# EAGLE design 20230822 (EAGLE 6.6.0)

## Sheet 1 of 3
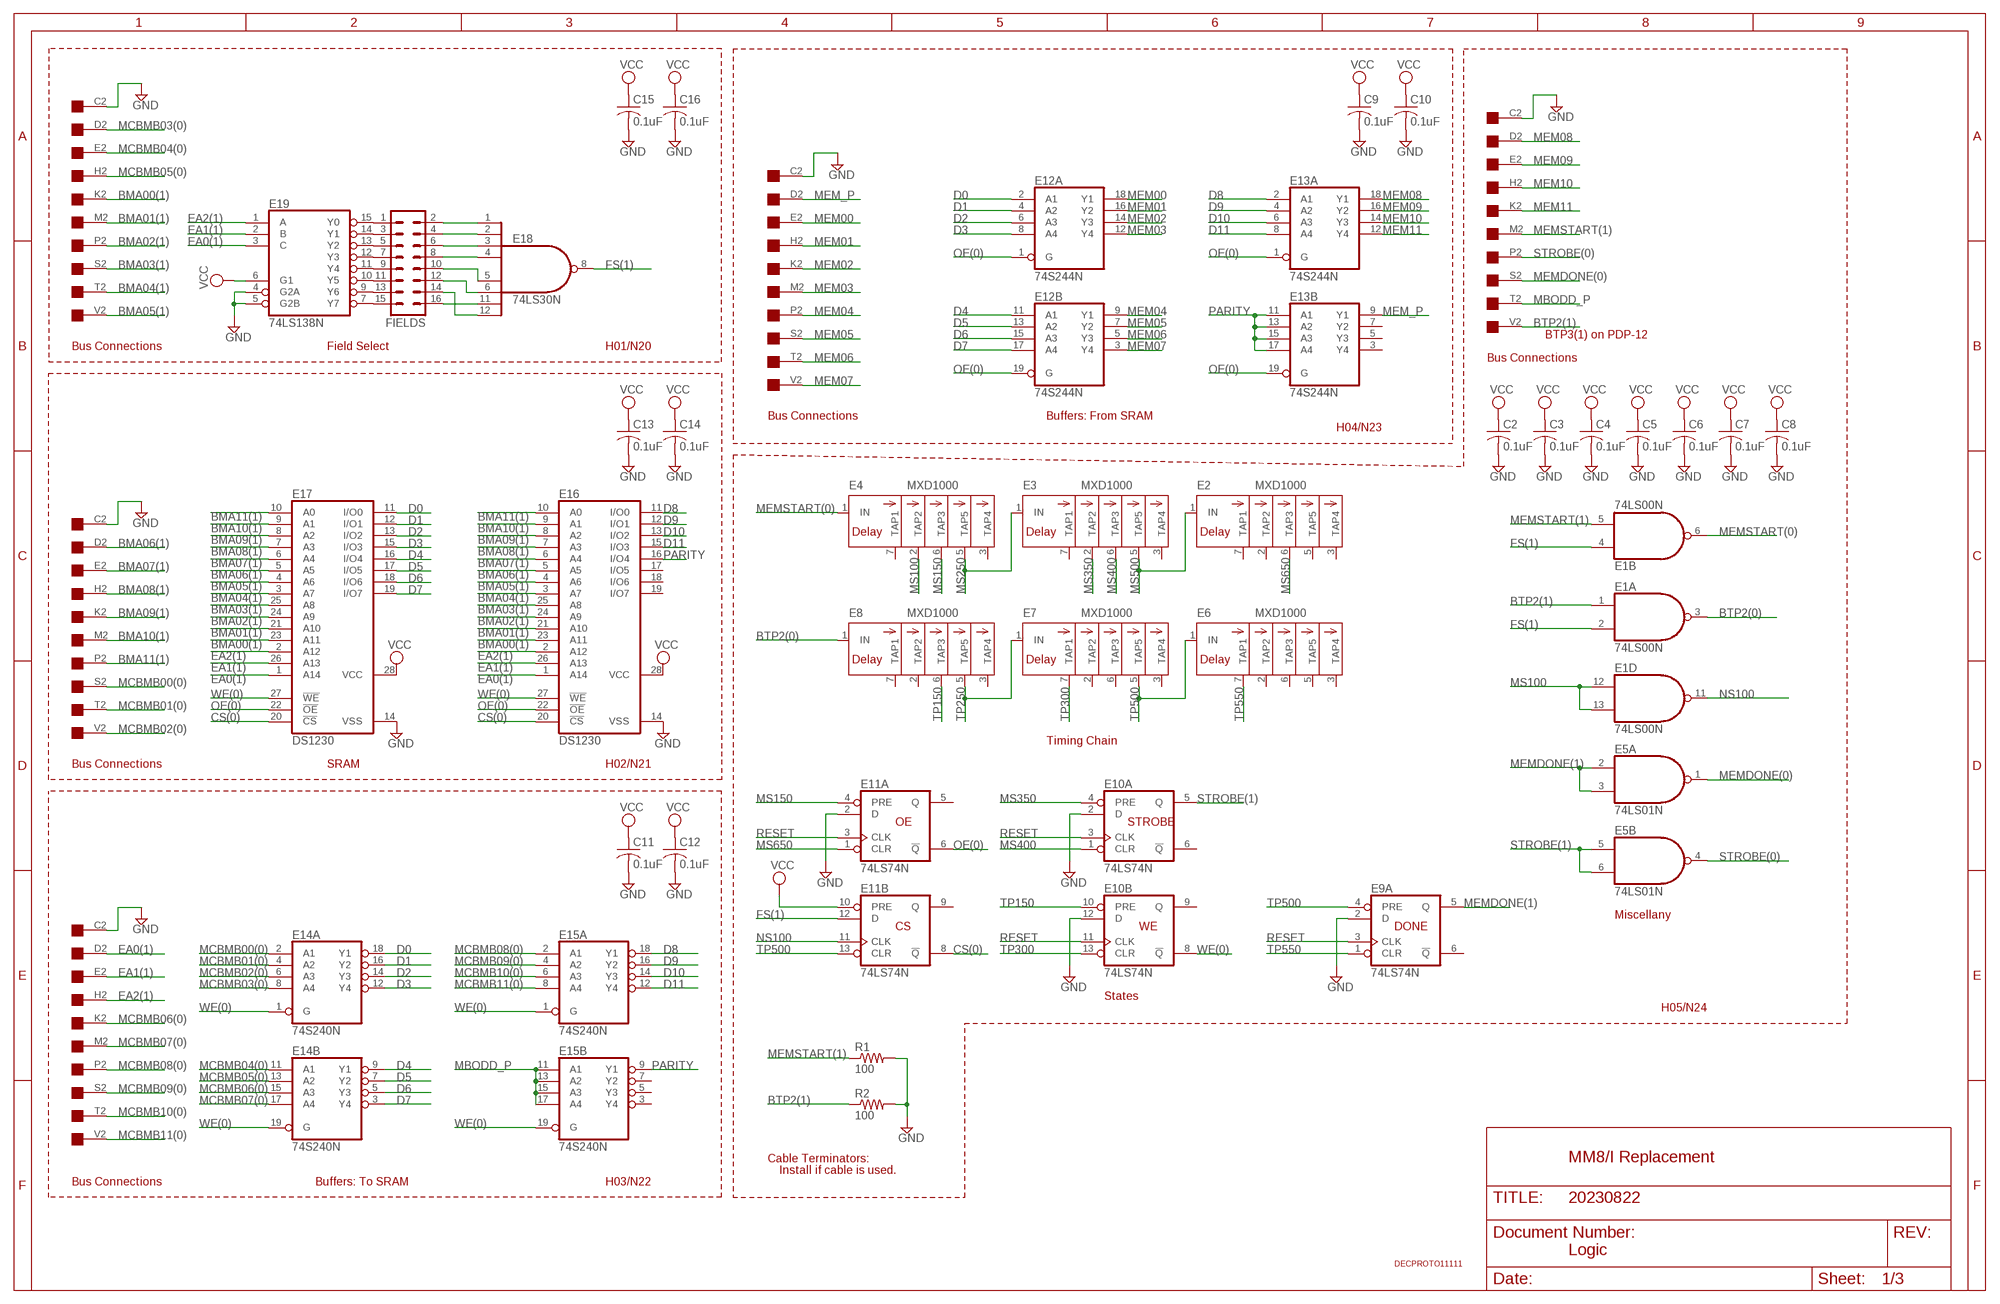
[diagram p0: schematic, sheet 1]

### Parts
C2  0.1uF  C-US050-025X075  [C050-025X075]
C3  0.1uF  C-US050-025X075  [C050-025X075]
C4  0.1uF  C-US050-025X075  [C050-025X075]
C5  0.1uF  C-US050-025X075  [C050-025X075]
C6  0.1uF  C-US050-025X075  [C050-025X075]
C7  0.1uF  C-US050-025X075  [C050-025X075]
C8  0.1uF  C-US050-025X075  [C050-025X075]
C9  0.1uF  C-US050-025X075  [C050-025X075]
C10  0.1uF  C-US050-025X075  [C050-025X075]
C11  0.1uF  C-US050-025X075  [C050-025X075]
C12  0.1uF  C-US050-025X075  [C050-025X075]
C13  0.1uF  C-US050-025X075  [C050-025X075]
C14  0.1uF  C-US050-025X075  [C050-025X075]
C15  0.1uF  C-US050-025X075  [C050-025X075]
C16  0.1uF  C-US050-025X075  [C050-025X075]
E1  74LS00N  [DIL14]
E2  MXD1000  [DIL08]
E3  MXD1000  [DIL08]
E4  MXD1000  [DIL08]
E5  74LS01N  [DIL14]
E6  MXD1000  [DIL08]
E7  MXD1000  [DIL08]
E8  MXD1000  [DIL08]
E9  74LS74N  [DIL14]
E10  74LS74N  [DIL14]
E11  74LS74N  [DIL14]
E12  74S244N  [DIL20]
E13  74S244N  [DIL20]
E14  74S240N  [DIL20]
E15  74S240N  [DIL20]
E16  DS1230  62256P  [DIL28-6]
E17  DS1230  62256P  [DIL28-6]
E18  74LS30N  [DIL14]
E19  74LS138N  [DIL16]
FIELDS  MA08-2  [MA08-2]
H01  EDGE-1  [EDGE-CON1]
H02  EDGE-1  [EDGE-CON1]
H03  EDGE-1  [EDGE-CON1]
H04  EDGE-1  [EDGE-CON1]
H05  EDGE-1  [EDGE-CON1]
R1  100  R-US_0207/10  [0207/10]
R2  100  R-US_0207/10  [0207/10]
U$6  DECPROTO11111  [DECPROTO11111]

### Nets
BMA00(1): E16.23(A11) E17.23(A11) H01.K2 ; also sheet 2
BMA01(1): E16.21(A10) E17.21(A10) H01.M2 ; also sheet 2
BMA02(1): E16.24(A9) E17.24(A9) H01.P2 ; also sheet 2
BMA03(1): E16.25(A8) E17.25(A8) H01.S2 ; also sheet 2
BMA04(1): E16.3(A7) E17.3(A7) H01.T2 ; also sheet 2
BMA05(1): E16.4(A6) E17.4(A6) H01.V2 ; also sheet 2
BMA06(1): E16.5(A5) E17.5(A5) H02.D2 ; also sheet 2
BMA07(1): E16.6(A4) E17.6(A4) H02.E2 ; also sheet 2
BMA08(1): E16.7(A3) E17.7(A3) H02.H2 ; also sheet 2
BMA09(1): E16.8(A2) E17.8(A2) H02.K2 ; also sheet 2
BMA10(1): E16.9(A1) E17.9(A1) H02.M2 ; also sheet 2
BMA11(1): E16.10(A0) E17.10(A0) H02.P2 ; also sheet 2
BTP2(0): E1.3(A:O) E8.1(IN)
BTP2(1): E1.1(A:I0) H05.V2 R2.1
CS(0): E11.8(B:!Q) E16.20(!CS) E17.20(!CS) ; also sheet 2
D0: E12.2(A:A1) E14.18(A:Y1) E17.11(I/O0) ; also sheet 2
D1: E12.4(A:A2) E14.16(A:Y2) E17.12(I/O1) ; also sheet 2
D2: E12.6(A:A3) E14.14(A:Y3) E17.13(I/O2) ; also sheet 2
D3: E12.8(A:A4) E14.12(A:Y4) E17.15(I/O3) ; also sheet 2
D4: E12.11(B:A1) E14.9(B:Y1) E17.16(I/O4) ; also sheet 2
D5: E12.13(B:A2) E14.7(B:Y2) E17.17(I/O5) ; also sheet 2
D6: E12.15(B:A3) E14.5(B:Y3) E17.18(I/O6) ; also sheet 2
D7: E12.17(B:A4) E14.3(B:Y4) E17.19(I/O7) ; also sheet 2
D8: E13.2(A:A1) E15.18(A:Y1) E16.11(I/O0) ; also sheet 2
D9: E13.4(A:A2) E15.16(A:Y2) E16.12(I/O1) ; also sheet 2
D10: E13.6(A:A3) E15.14(A:Y3) E16.13(I/O2) ; also sheet 2
D11: E13.8(A:A4) E15.12(A:Y4) E16.15(I/O3) ; also sheet 2
EA0(1): E16.1(A14) E17.1(A14) E19.3(C) H03.D2 ; also sheet 2
EA1(1): E16.26(A13) E17.26(A13) E19.2(B) H03.E2 ; also sheet 2
EA2(1): E16.2(A12) E17.2(A12) E19.1(A) H03.H2 ; also sheet 2
FS(1): E1.2(A:I1) E1.4(B:I0) E11.12(B:D) E18.8(O) ; also sheet 2
GND [supply]: C2.2 C3.2 C4.2 C5.2 C6.2 C7.2 C8.2 C9.2 C10.2 C11.2 C12.2 C13.2 C14.2 C15.2 C16.2 E9.2(A:D) E10.2(A:D) E10.12(B:D) E11.2(A:D) E16.14(VSS) E17.14(VSS) E19.4(G2A) E19.5(G2B) H01.C2 H02.C2 H03.C2 H04.C2 H05.C2 R1.2 R2.2 ; also sheet 2
MBODD_P: E15.11(B:A1) E15.13(B:A2) E15.15(B:A3) E15.17(B:A4) H05.T2 ; also sheet 2
MCBMB00(0): E14.2(A:A1) H02.S2 ; also sheet 2
MCBMB01(0): E14.4(A:A2) H02.T2 ; also sheet 2
MCBMB02(0): E14.6(A:A3) H02.V2 ; also sheet 2
MCBMB03(0): E14.8(A:A4) H01.D2 ; also sheet 2
MCBMB04(0): E14.11(B:A1) H01.E2 ; also sheet 2
MCBMB05(0): E14.13(B:A2) H01.H2 ; also sheet 2
MCBMB06(0): E14.15(B:A3) H03.K2
MCBMB07(0): E14.17(B:A4) H03.M2
MCBMB08(0): E15.2(A:A1) H03.P2
MCBMB09(0): E15.4(A:A2) H03.S2
MCBMB10(0): E15.6(A:A3) H03.T2
MCBMB11(0): E15.8(A:A4) H03.V2
MEM00: E12.18(A:Y1) H04.E2
MEM01: E12.16(A:Y2) H04.H2
MEM02: E12.14(A:Y3) H04.K2
MEM03: E12.12(A:Y4) H04.M2
MEM04: E12.9(B:Y1) H04.P2
MEM05: E12.7(B:Y2) H04.S2
MEM06: E12.5(B:Y3) H04.T2
MEM07: E12.3(B:Y4) H04.V2
MEM08: E13.18(A:Y1) H05.D2 ; also sheet 2
MEM09: E13.16(A:Y2) H05.E2 ; also sheet 2
MEM10: E13.14(A:Y3) H05.H2 ; also sheet 2
MEM11: E13.12(A:Y4) H05.K2 ; also sheet 2
MEM_P: E13.9(B:Y1) H04.D2
MEMDONE(0): E5.1(A:O) H05.S2
MEMDONE(1): E5.2(A:I0) E5.3(A:I1) E9.5(A:Q)
MEMSTART(0): E1.6(B:O) E4.1(IN) ; also sheet 2
MEMSTART(1): E1.5(B:I1) H05.M2 R1.1
MS100: E1.12(D:I0) E1.13(D:I1) E4.2(TAP2)
MS150: E4.6(TAP3) E11.4(A:PRE)
MS250: E3.1(IN) E4.5(TAP5)
MS350: E3.2(TAP2) E10.4(A:PRE)
MS400: E3.6(TAP3) E10.1(A:CLR)
MS500: E2.1(IN) E3.5(TAP5)
MS650: E2.6(TAP3) E11.1(A:CLR)
N$18: E19.15(Y0) FIELDS.1
N$19: E19.14(Y1) FIELDS.3
N$20: E19.13(Y2) FIELDS.5
N$21: E19.12(Y3) FIELDS.7
N$22: E19.11(Y4) FIELDS.9
N$23: E19.10(Y5) FIELDS.11
N$24: E19.9(Y6) FIELDS.13
N$25: E19.7(Y7) FIELDS.15
N$26: E18.4(I3) FIELDS.8
N$27: E18.3(I2) FIELDS.6
N$28: E18.2(I1) FIELDS.4
N$29: E18.1(I0) FIELDS.2
N$30: E18.5(I4) FIELDS.10
N$31: E18.6(I5) FIELDS.12
N$32: E18.12(I7) FIELDS.14
N$33: E18.11(I6) FIELDS.16
NS100: E1.11(D:O) E11.11(B:CLK)
OE(0): E11.6(A:!Q) E12.1(A:G) E12.19(B:G) E13.1(A:G) E13.19(B:G) E16.22(!OE) E17.22(!OE) ; also sheet 2
PARITY: E13.11(B:A1) E13.13(B:A2) E13.15(B:A3) E13.17(B:A4) E15.9(B:Y1) E16.16(I/O4) ; also sheet 2
RESET: E9.3(A:CLK) E10.3(A:CLK) E10.11(B:CLK) E11.3(A:CLK) ; also sheet 2
STROBE(0): E5.4(B:O) H05.P2
STROBE(1): E5.5(B:I0) E5.6(B:I1) E10.5(A:Q)
TP150: E8.6(TAP3) E10.10(B:PRE)
TP250: E7.1(IN) E8.5(TAP5)
TP300: E7.7(TAP1) E10.13(B:CLR)
TP500: E6.1(IN) E7.5(TAP5) E9.4(A:PRE) E11.13(B:CLR)
TP550: E6.7(TAP1) E9.1(A:CLR)
VCC [supply]: C2.1 C3.1 C4.1 C5.1 C6.1 C7.1 C8.1 C9.1 C10.1 C11.1 C12.1 C13.1 C14.1 C15.1 C16.1 E11.10(B:PRE) E16.28(VCC) E17.28(VCC) E19.6(G1) ; also sheet 2
WE(0): E10.8(B:!Q) E14.1(A:G) E14.19(B:G) E15.1(A:G) E15.19(B:G) E16.27(!WE) E17.27(!WE) ; also sheet 2
Unconnected: E2.2(TAP2) E2.3(TAP4) E2.5(TAP5) E2.7(TAP1) E3.3(TAP4) E3.7(TAP1) E4.3(TAP4) E4.7(TAP1) E6.2(TAP2) E6.3(TAP4) E6.5(TAP5) E6.6(TAP3) E7.2(TAP2) E7.3(TAP4) E7.6(TAP3) E8.2(TAP2) E8.3(TAP4) E8.7(TAP1) E9.6(A:!Q) E10.6(A:!Q) E10.9(B:Q) E11.5(A:Q) E11.9(B:Q) E13.3(B:Y4) E13.5(B:Y3) E13.7(B:Y2) E15.3(B:Y4) E15.5(B:Y3) E15.7(B:Y2) E16.17(I/O5) E16.18(I/O6) E16.19(I/O7) H01.A2 H01.B2 H01.F2 H01.J2 H01.L2 H01.N2 H01.R2 H01.U2 H02.A2 H02.B2 H02.F2 H02.J2 H02.L2 H02.N2 H02.R2 H02.U2 H03.A2 H03.B2 H03.F2 H03.J2 H03.L2 H03.N2 H03.R2 H03.U2 H04.A2 H04.B2 H04.F2 H04.J2 H04.L2 H04.N2 H04.R2 H04.U2 H05.A2 H05.B2 H05.F2 H05.J2 H05.L2 H05.N2 H05.R2 H05.U2

### Notes on the sheet
- BTP3(1) on PDP-12
- Bus Connections | Field Select | H01/N20
- Bus Connections
- Bus Connections | Buffers: From SRAM
- H04/N23
- Timing Chain
- Bus Connections | SRAM | H02/N21
- OE | STROBE
- Miscellany
- CS | WE | DONE
- States
- H05/N24
- Cable Terminators: | MM8/I Replacement
- Install if cable is used.
- Bus Connections | Buffers: To SRAM | H03/N22
- Logic

## Sheet 2 of 3
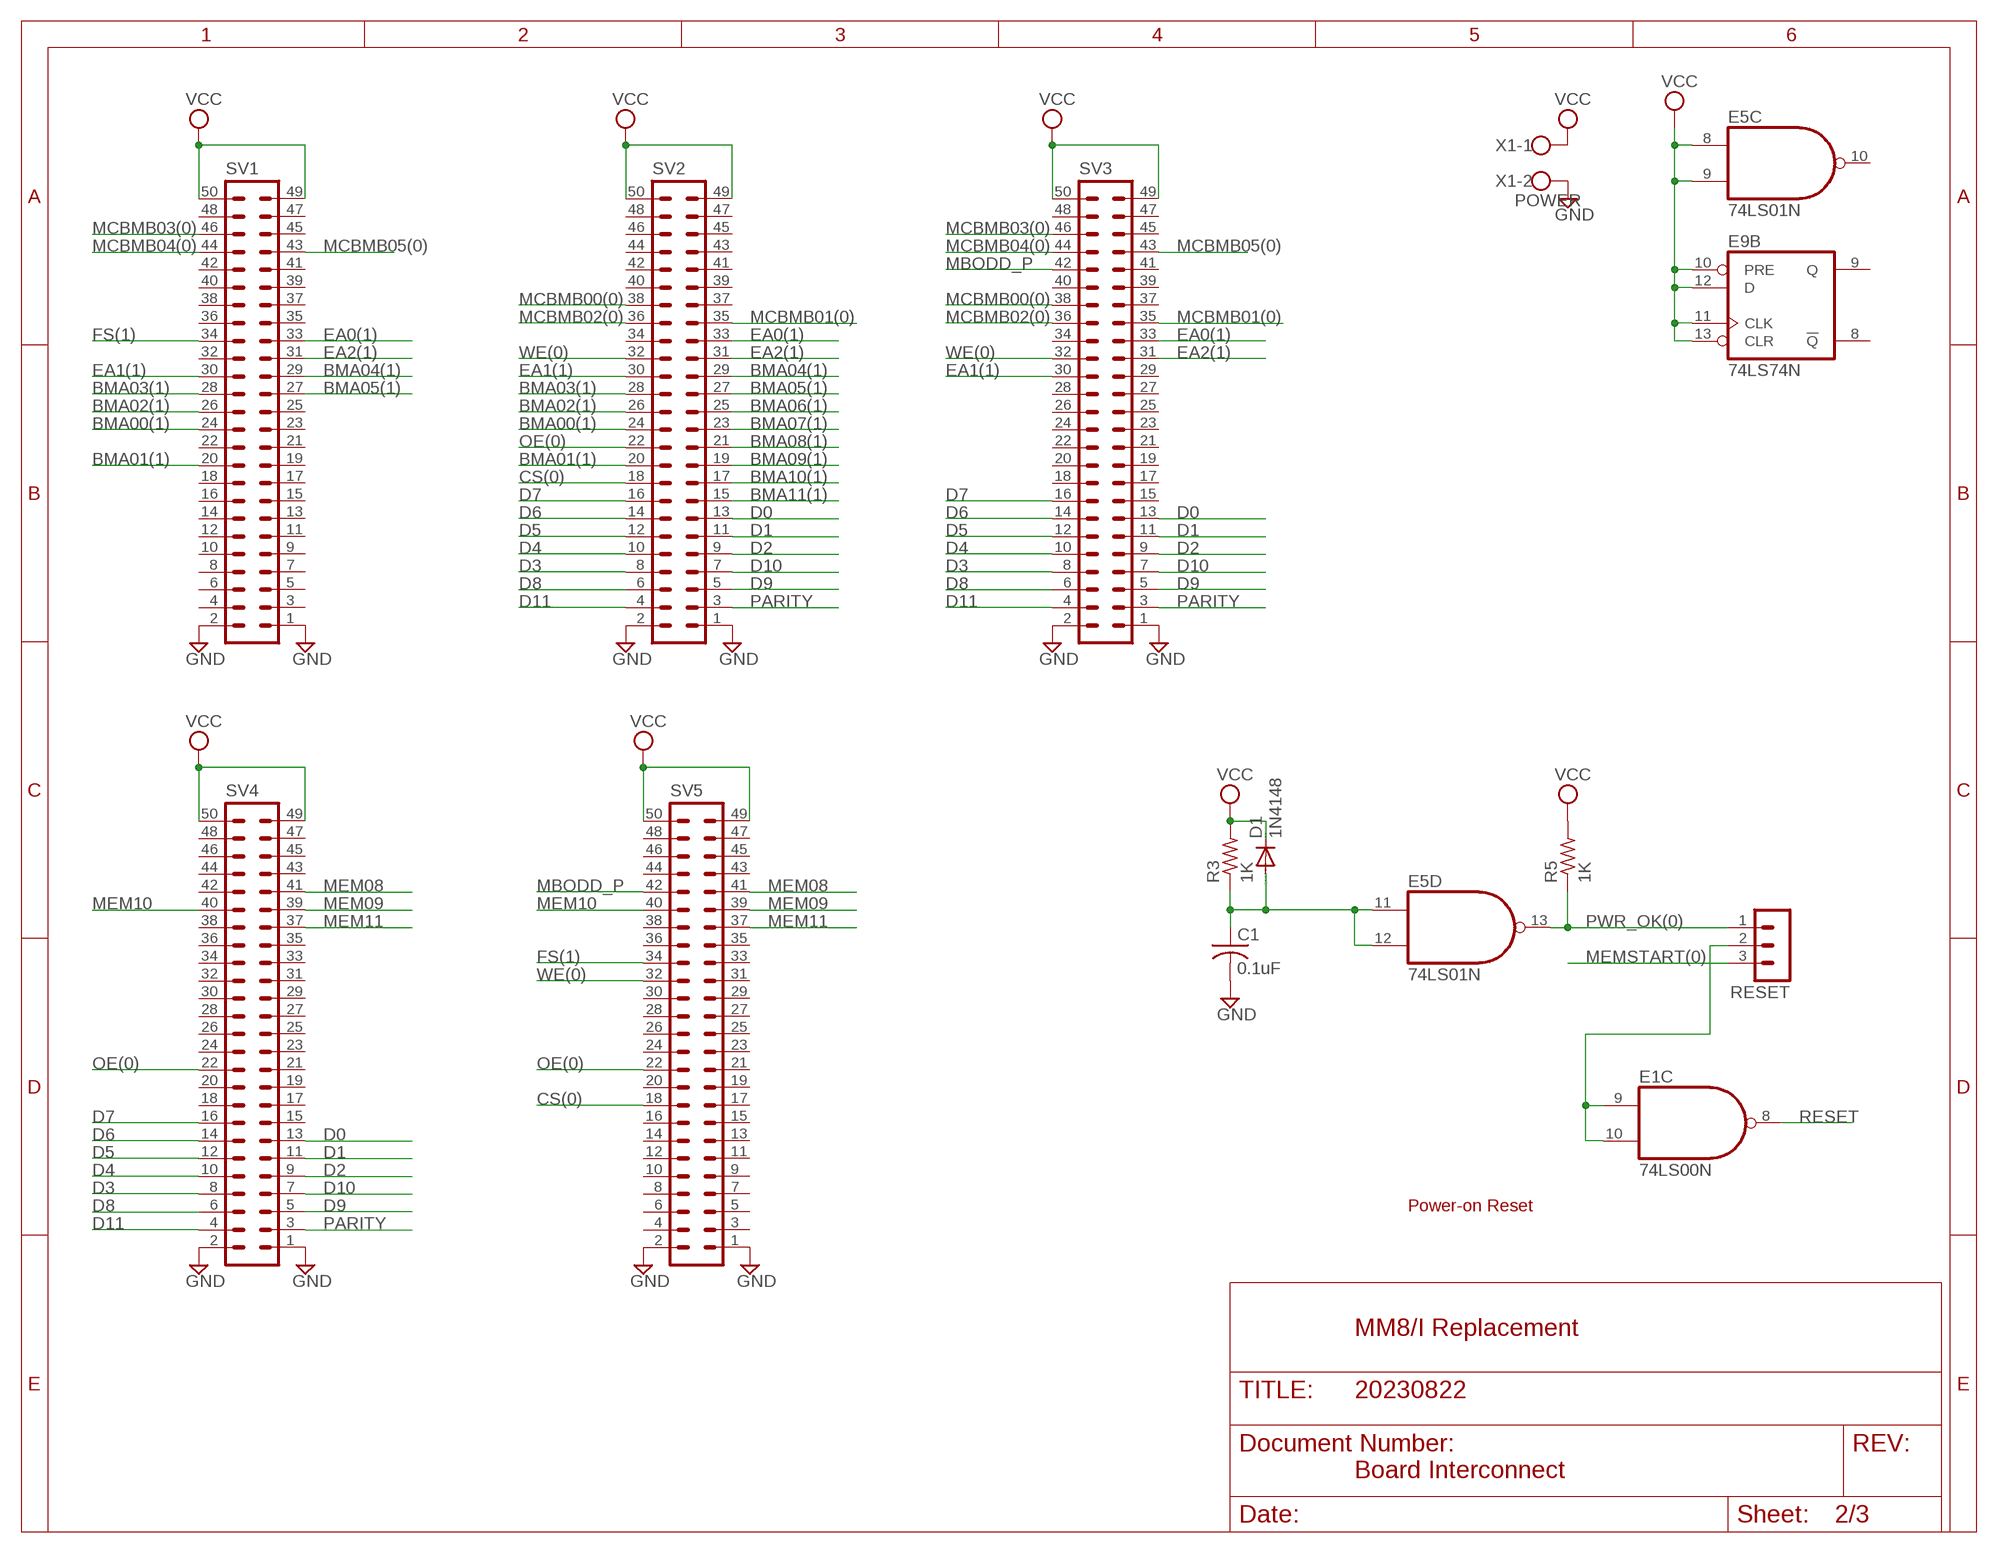
[diagram p1: schematic, sheet 2]

### Parts
C1  0.1uF  C-US050-025X075  [C050-025X075]
D1  1N4148  1N4148DO35-10  [DO35-10]
R3  1K  R-US_0207/10  [0207/10]
R5  1K  R-US_0207/10  [0207/10]
RESET  MA03-1  [MA03-1]
SV1  ML50L  [ML50L]
SV2  ML50L  [ML50L]
SV3  ML50L  [ML50L]
SV4  ML50L  [ML50L]
SV5  ML50L  [ML50L]
X1  POWER  W237-102  [W237-102]

### Nets
BMA00(1): SV1.24 SV2.24 ; also sheet 1
BMA01(1): SV1.20 SV2.20 ; also sheet 1
BMA02(1): SV1.26 SV2.26 ; also sheet 1
BMA03(1): SV1.28 SV2.28 ; also sheet 1
BMA04(1): SV1.29 SV2.29 ; also sheet 1
BMA05(1): SV1.27 SV2.27 ; also sheet 1
BMA06(1): SV2.25 ; also sheet 1
BMA07(1): SV2.23 ; also sheet 1
BMA08(1): SV2.21 ; also sheet 1
BMA09(1): SV2.19 ; also sheet 1
BMA10(1): SV2.17 ; also sheet 1
BMA11(1): SV2.15 ; also sheet 1
CS(0): SV2.18 SV5.18 ; also sheet 1
D0: SV2.13 SV3.13 SV4.13 ; also sheet 1
D1: SV2.11 SV3.11 SV4.11 ; also sheet 1
D2: SV2.9 SV3.9 SV4.9 ; also sheet 1
D3: SV2.8 SV3.8 SV4.8 ; also sheet 1
D4: SV2.10 SV3.10 SV4.10 ; also sheet 1
D5: SV2.12 SV3.12 SV4.12 ; also sheet 1
D6: SV2.14 SV3.14 SV4.14 ; also sheet 1
D7: SV2.16 SV3.16 SV4.16 ; also sheet 1
D8: SV2.6 SV3.6 SV4.6 ; also sheet 1
D9: SV2.5 SV3.5 SV4.5 ; also sheet 1
D10: SV2.7 SV3.7 SV4.7 ; also sheet 1
D11: SV2.4 SV3.4 SV4.4 ; also sheet 1
EA0(1): SV1.33 SV2.33 SV3.33 ; also sheet 1
EA1(1): SV1.30 SV2.30 SV3.30 ; also sheet 1
EA2(1): SV1.31 SV2.31 SV3.31 ; also sheet 1
FS(1): SV1.34 SV5.34 ; also sheet 1
GND [supply]: C1.2 SV1.1 SV1.2 SV2.1 SV2.2 SV3.1 SV3.2 SV4.1 SV4.2 SV5.1 SV5.2 X1.2 ; also sheet 1
MBODD_P: SV3.42 SV5.42 ; also sheet 1
MCBMB00(0): SV2.38 SV3.38 ; also sheet 1
MCBMB01(0): SV2.35 SV3.35 ; also sheet 1
MCBMB02(0): SV2.36 SV3.36 ; also sheet 1
MCBMB03(0): SV1.46 SV3.46 ; also sheet 1
MCBMB04(0): SV1.44 SV3.44 ; also sheet 1
MCBMB05(0): SV1.43 SV3.43 ; also sheet 1
MEM08: SV4.41 SV5.41 ; also sheet 1
MEM09: SV4.39 SV5.39 ; also sheet 1
MEM10: SV4.40 SV5.40 ; also sheet 1
MEM11: SV4.37 SV5.37 ; also sheet 1
MEMSTART(0): RESET.3 ; also sheet 1
N$1: E1.9(C:I0) E1.10(C:I1) RESET.2
OE(0): SV2.22 SV4.22 SV5.22 ; also sheet 1
PARITY: SV2.3 SV3.3 SV4.3 ; also sheet 1
PWR_OK: C1.1 D1.A E5.11(D:I0) E5.12(D:I1) R3.1
PWR_OK(0): E5.13(D:O) R5.1 RESET.1
RESET: E1.8(C:O) ; also sheet 1
VCC [supply]: D1.C E5.8(C:I0) E5.9(C:I1) E9.10(B:PRE) E9.11(B:CLK) E9.12(B:D) E9.13(B:CLR) R3.2 R5.2 SV1.49 SV1.50 SV2.49 SV2.50 SV3.49 SV3.50 SV4.49 SV4.50 SV5.49 SV5.50 X1.1 ; also sheet 1
WE(0): SV2.32 SV3.32 SV5.32 ; also sheet 1
Unconnected: E5.10(C:O) E9.8(B:!Q) E9.9(B:Q) SV1.3 SV1.4 SV1.5 SV1.6 SV1.7 SV1.8 SV1.9 SV1.10 SV1.11 SV1.12 SV1.13 SV1.14 SV1.15 SV1.16 SV1.17 SV1.18 SV1.19 SV1.21 SV1.22 SV1.23 SV1.25 SV1.32 SV1.35 SV1.36 SV1.37 SV1.38 SV1.39 SV1.40 SV1.41 SV1.42 SV1.45 SV1.47 SV1.48 SV2.34 SV2.37 SV2.39 SV2.40 SV2.41 SV2.42 SV2.43 SV2.44 SV2.45 SV2.46 SV2.47 SV2.48 SV3.15 SV3.17 SV3.18 SV3.19 SV3.20 SV3.21 SV3.22 SV3.23 SV3.24 SV3.25 SV3.26 SV3.27 SV3.28 SV3.29 SV3.34 SV3.37 SV3.39 SV3.40 SV3.41 SV3.45 SV3.47 SV3.48 SV4.15 SV4.17 SV4.18 SV4.19 SV4.20 SV4.21 SV4.23 SV4.24 SV4.25 SV4.26 SV4.27 SV4.28 SV4.29 SV4.30 SV4.31 SV4.32 SV4.33 SV4.34 SV4.35 SV4.36 SV4.38 SV4.42 SV4.43 SV4.44 SV4.45 SV4.46 SV4.47 SV4.48 SV5.3 SV5.4 SV5.5 SV5.6 SV5.7 SV5.8 SV5.9 SV5.10 SV5.11 SV5.12 SV5.13 SV5.14 SV5.15 SV5.16 SV5.17 SV5.19 SV5.20 SV5.21 SV5.23 SV5.24 SV5.25 SV5.26 SV5.27 SV5.28 SV5.29 SV5.30 SV5.31 SV5.33 SV5.35 SV5.36 SV5.38 SV5.43 SV5.44 SV5.45 SV5.46 SV5.47 SV5.48

### Notes on the sheet
- Power-on Reset
- MM8/I Replacement
- Board Interconnect

## Sheet 3 of 3
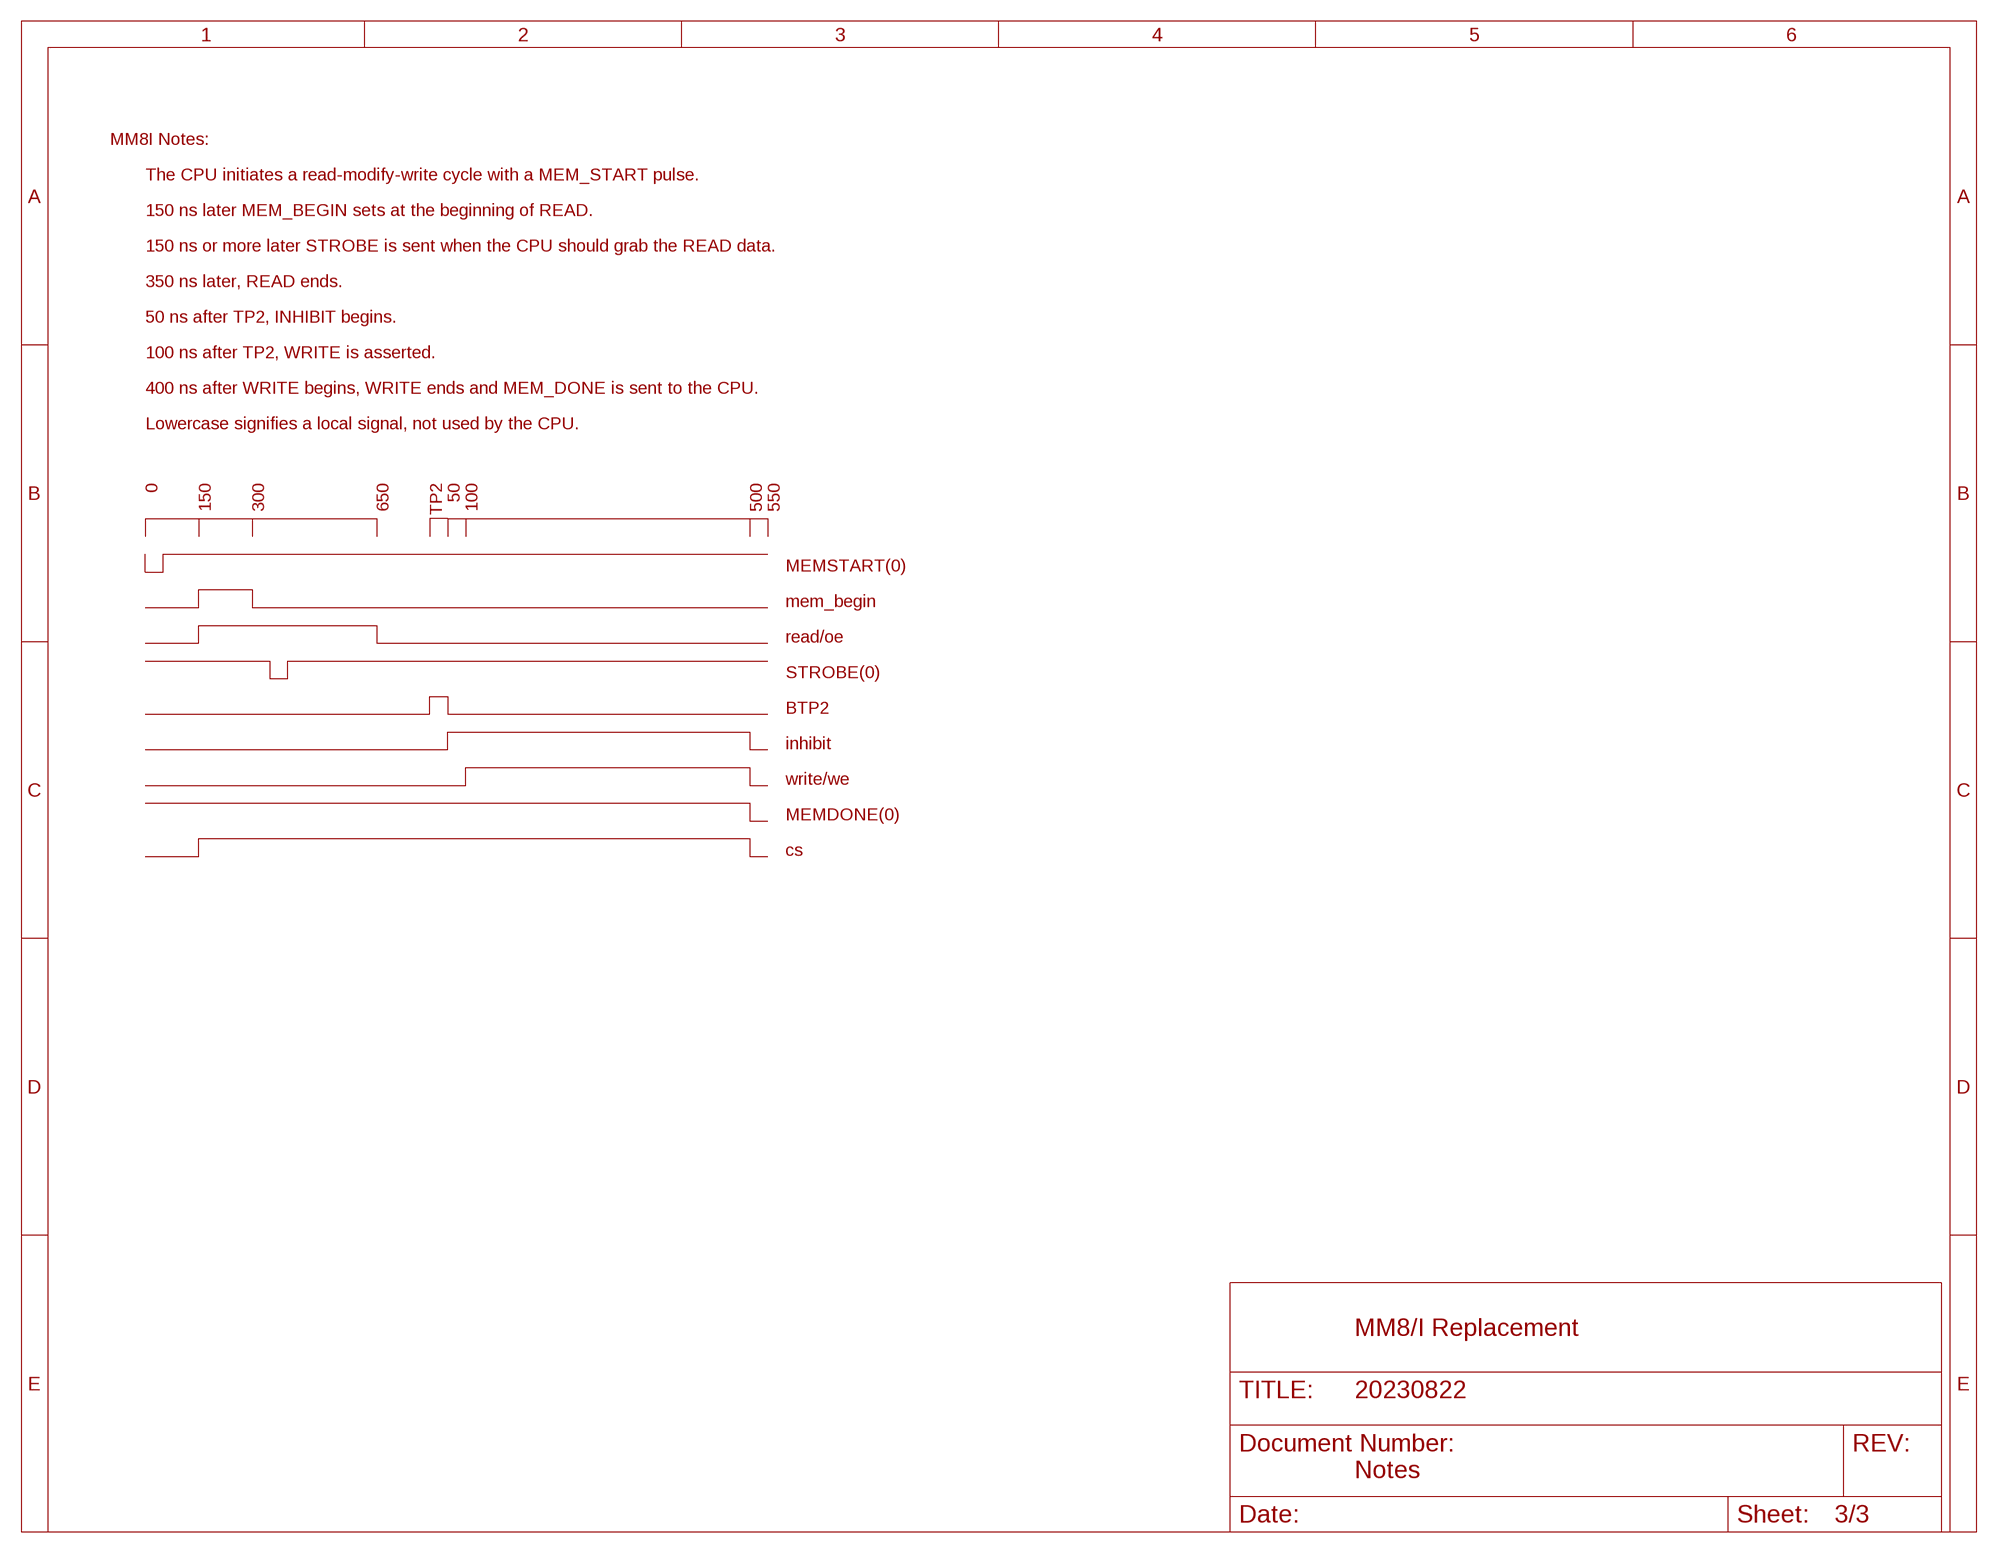
[diagram p2: schematic, sheet 3]

### Notes on the sheet
- MM8I Notes:
- The CPU initiates a read-modify-write cycle with a MEM_START pulse.
- 150 ns later MEM_BEGIN sets at the beginning of READ.
- 150 ns or more later STROBE is sent when the CPU should grab the READ data.
- 350 ns later, READ ends.
- 50 ns after TP2, INHIBIT begins.
- 100 ns after TP2, WRITE is asserted.
- 400 ns after WRITE begins, WRITE ends and MEM_DONE is sent to the CPU.
- Lowercase signifies a local signal, not used by the CPU.
- 0 | 150 | 300 | 650 | TP2 | 50 | 100 | 500 | 550
- MEMSTART(0)
- mem_begin
- read/oe
- STROBE(0)
- BTP2
- inhibit
- write/we
- MEMDONE(0)
- cs
- MM8/I Replacement
- Notes

## Power pins joined to a net without a drawn wire
GND: E1.7(P:GND) E2.4(GND) E3.4(GND) E4.4(GND) E5.7(P:GND) E6.4(GND) E7.4(GND) E8.4(GND) E9.7(P:GND) E10.7(P:GND) E11.7(P:GND) E12.10(P:GND) E13.10(P:GND) E14.10(P:GND) E15.10(P:GND) E18.7(GND) E19.8(GND)
VCC: E1.14(P:VCC) E2.8(VCC) E3.8(VCC) E4.8(VCC) E5.14(P:VCC) E6.8(VCC) E7.8(VCC) E8.8(VCC) E9.14(P:VCC) E10.14(P:VCC) E11.14(P:VCC) E12.20(P:VCC) E13.20(P:VCC) E14.20(P:VCC) E15.20(P:VCC) E18.14(VCC) E19.16(VCC)

## Library data of the parts
C1-C16 = rcl:C-US: CAPACITOR, American symbol
D1 = diode:1N4148: DIODE high speed (Philips)
E1 = 74xx-us:74*00: Quad 2-input NAND gate
E2-E4 E6-E8 = maxim:MXD1000: DELAY LINE; OC_FARNELL: unknown; OC_NEWARK: unknown
E5 = 74xx-us:74*01: Quad 2-input NAND gate, open collector
E9-E11 = 74xx-us:74*74: Dual D type positive edge triggered FLIP FLOP, preset and clear
E12 E13 = 74xx-us:74*244: Octal BUFFER and LINE DRIVER, 3-state
E14 E15 = 74xx-us:74*240: Octal BUFFER and LINE DRIVER, 3-state
E16 E17 = memory-hitachi:62256P: MEMORY; OC_FARNELL: unknown; OC_NEWARK: unknown
E18 = 74xx-us:74*30: 8-input NAND gate
E19 = 74xx-us:74*138: 3-line to 8-line DECODER/DEMULTIPLEXER
FIELDS = con-lstb:MA08-2: PIN HEADER; OC_FARNELL: unknown; OC_NEWARK: unknown
H01-H05 = dec-con:EDGE-1: Single-Sided DEC Edge Connector -- (side 2)
R1-R3 R5 = rcl:R-US_: RESISTOR, American symbol
RESET = con-lstb:MA03-1: PIN HEADER; OC_FARNELL: unknown; OC_NEWARK: unknown
SV1-SV5 = con-ml:ML50L: HARTING; OC_FARNELL: unknown; OC_NEWARK: unknown
U$6 = dec-con:DECPROTO: Various small DEC boards stuck together with break-away tab routing.
X1 = con-wago-500:W237-102: WAGO SCREW CLAMP; MPN: 237-102; OC_FARNELL: unknown; OC_NEWARK: 70K9898

## Net classes
1 supply: width 0.711 mm

## Board
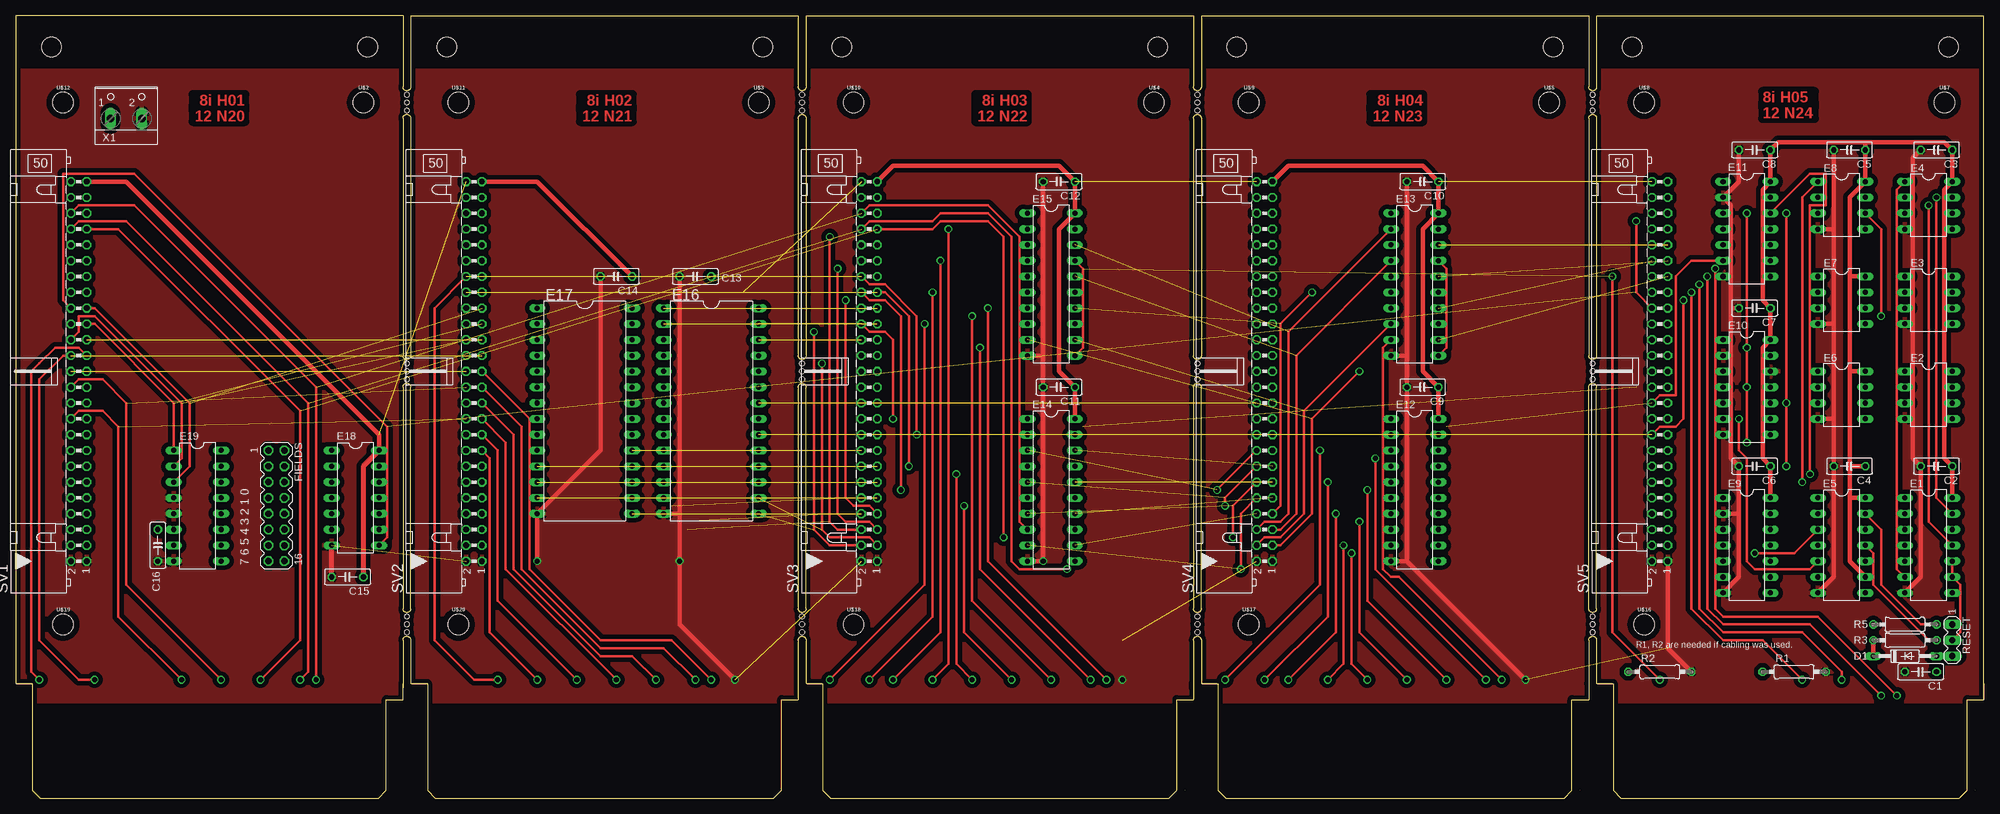
[diagram p3: board, top side]
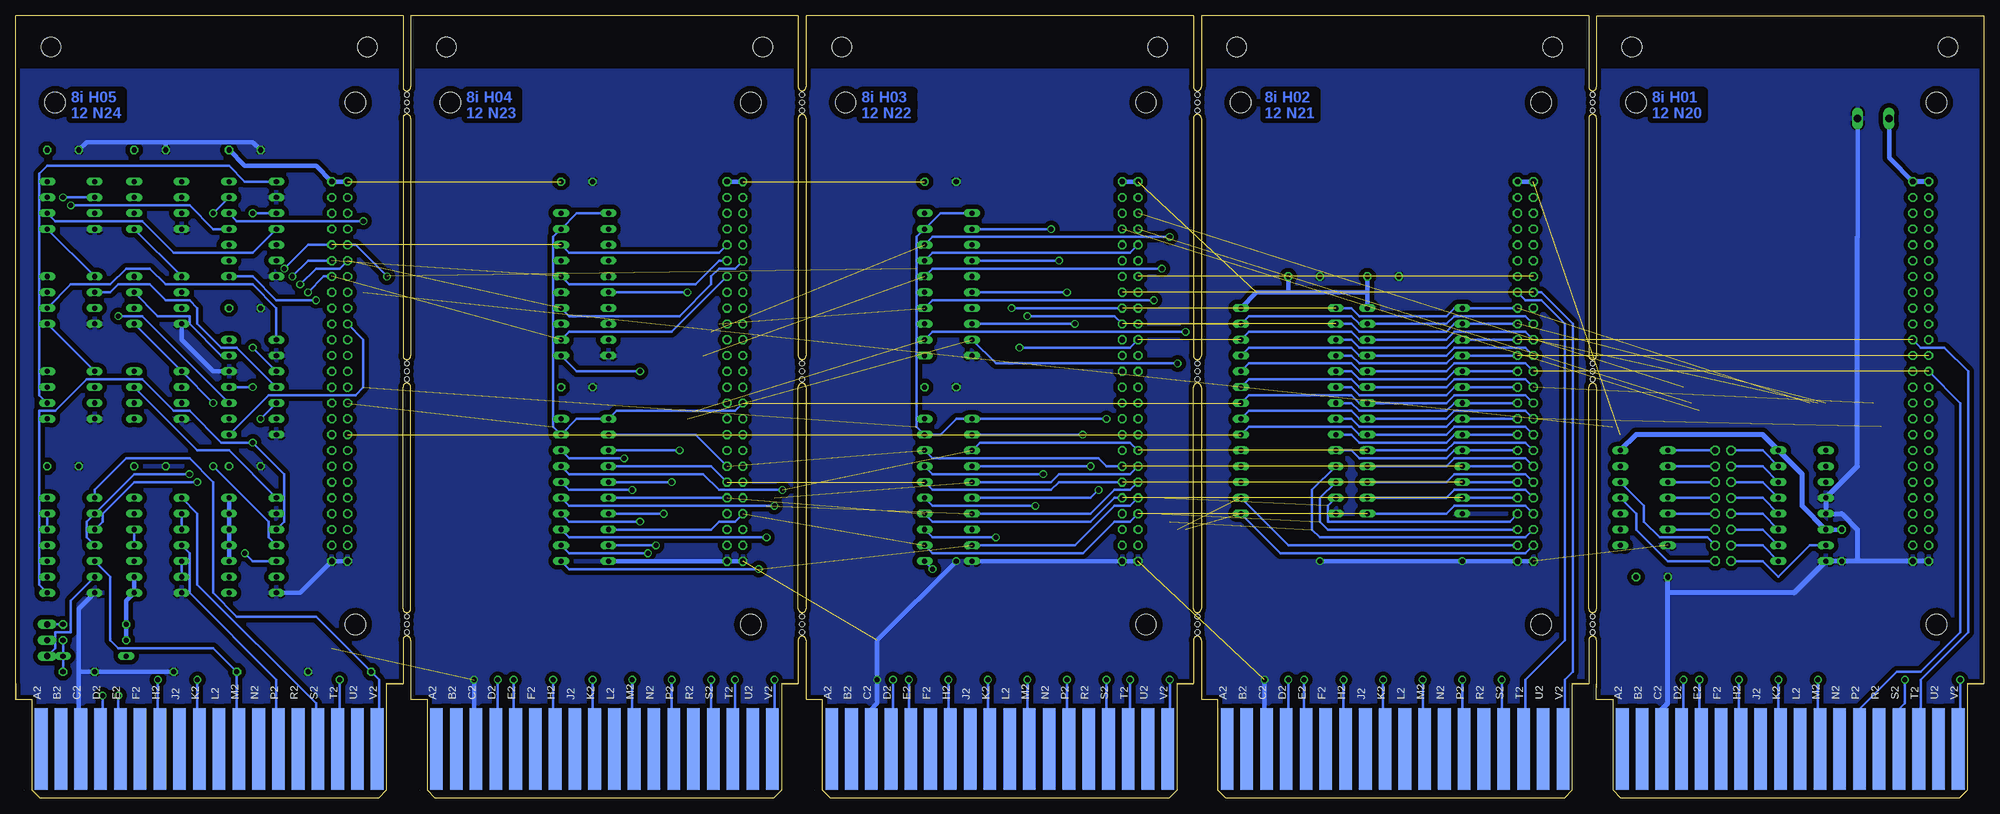
[diagram p4: board, bottom side, seen from below]

Size 316.23 x 125.73 mm. Coordinates in mm from the lower left corner, seen from the top.
Copper layers (1+16): Top 0.035mm / dielectric 1.5mm / Bottom 0.035mm
Design rules "16mils": minimum track width 16mil, minimum drill 32mil, track to track 15mil, track to pad 10mil, pad to pad 10mil, via to via 10mil, smd to smd 10mil, copper to edge 13mil, drill to drill 10mil, minimum pad ring 10mil, minimum via ring 8mil, stop-mask expansion 0mil, vias tented up to drill 0mil, thermal gap 10mil

### Footprints (pad centres in the part's own frame; a part is rotated, then mirrored left to right if it is on the bottom)
C050-025X075 = drill 0.813 octagon: 1 -2.54,0; 2 2.54,0
DO35-10 = drill 0.813 long: A 5.08,0; C -5.08,0
DIL14 = drill 0.813 long: 1 -7.62,-3.81; 2 -5.08,-3.81; 3 -2.54,-3.81; 4 0,-3.81; 5 2.54,-3.81; 6 5.08,-3.81; 7 7.62,-3.81; 8 7.62,3.81; 9 5.08,3.81; 10 2.54,3.81; 11 0,3.81; 12 -2.54,3.81; 13 -5.08,3.81; 14 -7.62,3.81
DIL08 = drill 0.813 long: 1 -3.81,-3.81; 2 -1.27,-3.81; 3 1.27,-3.81; 4 3.81,-3.81; 5 3.81,3.81; 6 1.27,3.81; 7 -1.27,3.81; 8 -3.81,3.81
DIL20 = drill 0.813 long: 1 -11.43,-3.81; 2 -8.89,-3.81; 3 -6.35,-3.81; 4 -3.81,-3.81; 5 -1.27,-3.81; 6 1.27,-3.81; 7 3.81,-3.81; 8 6.35,-3.81; 9 8.89,-3.81; 10 11.43,-3.81; 11 11.43,3.81; 12 8.89,3.81; 13 6.35,3.81; 14 3.81,3.81; 15 1.27,3.81; 16 -1.27,3.81; 17 -3.81,3.81; 18 -6.35,3.81; 19 -8.89,3.81; 20 -11.43,3.81
DIL28-6 = drill 0.813 long: 1 -16.51,-7.62; 2 -13.97,-7.62; 3 -11.43,-7.62; 4 -8.89,-7.62; 5 -6.35,-7.62; 6 -3.81,-7.62; 7 -1.27,-7.62; 8 1.27,-7.62; 9 3.81,-7.62; 10 6.35,-7.62; 11 8.89,-7.62; 12 11.43,-7.62; 13 13.97,-7.62; 14 16.51,-7.62; 15 16.51,7.62; 16 13.97,7.62; 17 11.43,7.62; 18 8.89,7.62; 19 6.35,7.62; 20 3.81,7.62; 21 1.27,7.62; 22 -1.27,7.62; 23 -3.81,7.62; 24 -6.35,7.62; 25 -8.89,7.62; 26 -11.43,7.62; 27 -13.97,7.62; 28 -16.51,7.62
DIL16 = drill 0.813 long: 1 -8.89,-3.81; 2 -6.35,-3.81; 3 -3.81,-3.81; 4 -1.27,-3.81; 5 1.27,-3.81; 6 3.81,-3.81; 7 6.35,-3.81; 8 8.89,-3.81; 9 8.89,3.81; 10 6.35,3.81; 11 3.81,3.81; 12 1.27,3.81; 13 -1.27,3.81; 14 -3.81,3.81; 15 -6.35,3.81; 16 -8.89,3.81
MA08-2 = drill 1.016 octagon: 1 -8.89,-1.27; 2 -8.89,1.27; 3 -6.35,-1.27; 4 -6.35,1.27; 5 -3.81,-1.27; 6 -3.81,1.27; 7 -1.27,-1.27; 8 -1.27,1.27; 9 1.27,-1.27; 10 1.27,1.27; 11 3.81,-1.27; 12 3.81,1.27; 13 6.35,-1.27; 14 6.35,1.27; 15 8.89,-1.27; 16 8.89,1.27
EDGE-CON1 = smd 13.106 x 2.032 bottom: A2 7.938,4.128; B2 7.938,7.303; C2 7.938,10.477; D2 7.938,13.652; E2 7.938,16.828; F2 7.938,20.003; H2 7.938,23.177; J2 7.938,26.352; K2 7.938,29.527; L2 7.938,32.703; M2 7.938,35.877; N2 7.938,39.053; P2 7.938,42.227; R2 7.938,45.403; S2 7.938,48.578; T2 7.938,51.752; U2 7.938,54.928; V2 7.938,58.102
0207/10 = drill 0.813 octagon: 1 -5.08,0; 2 5.08,0
MA03-1 = drill 1.016 long: 1 -2.54,0; 2 0,0; 3 2.54,0
ML50L = drill 0.914 octagon: 1 -30.48,-1.27; 2 -30.48,1.27; 3 -27.94,-1.27; 4 -27.94,1.27; 5 -25.4,-1.27; 6 -25.4,1.27; 7 -22.86,-1.27; 8 -22.86,1.27; 9 -20.32,-1.27; 10 -20.32,1.27; 11 -17.78,-1.27; 12 -17.78,1.27; 13 -15.24,-1.27; 14 -15.24,1.27; 15 -12.7,-1.27; 16 -12.7,1.27; 17 -10.16,-1.27; 18 -10.16,1.27; 19 -7.62,-1.27; 20 -7.62,1.27; 21 -5.08,-1.27; 22 -5.08,1.27; 23 -2.54,-1.27; 24 -2.54,1.27; 25 0,-1.27; 26 0,1.27; 27 2.54,-1.27; 28 2.54,1.27; 29 5.08,-1.27; 30 5.08,1.27; 31 7.62,-1.27; 32 7.62,1.27; 33 10.16,-1.27; 34 10.16,1.27; 35 12.7,-1.27; 36 12.7,1.27; 37 15.24,-1.27; 38 15.24,1.27; 39 17.78,-1.27; 40 17.78,1.27; 41 20.32,-1.27; 42 20.32,1.27; 43 22.86,-1.27; 44 22.86,1.27; 45 25.4,-1.27; 46 25.4,1.27; 47 27.94,-1.27; 48 27.94,1.27; 49 30.48,-1.27; 50 30.48,1.27
STAND-OFF = hole 3.302: 0,0
DECPROTO11111 = hole 3.175: 183.515,120.65; 132.715,120.65; 69.266,120.65; 120.066,120.65; 56.566,120.65; 5.766,120.65; 247.015,120.65; 196.215,120.65; 310.515,120.65; 259.715,120.65 | hole 0.813: 62.865,69.85; 62.865,68.58; 62.865,67.31; 62.865,26.67; 62.865,27.94; 62.865,29.21; 62.865,113.03; 62.865,110.49; 62.865,111.76; 126.365,69.85; 126.365,68.58; 126.365,67.31; 126.365,26.67; 126.365,27.94; 126.365,29.21; 126.365,113.03; 126.365,110.49; 126.365,111.76; 189.865,26.67; 189.865,27.94; 189.865,29.21; 189.865,67.31; 189.865,68.58; 189.865,69.85; 189.865,110.49; 189.865,111.76; 189.865,113.03; 253.365,26.67; 253.365,27.94; 253.365,29.21; 253.365,67.31; 253.365,68.58; 253.365,69.85; 253.365,110.49; 253.365,111.76; 253.365,113.03
W237-102 = drill 1.194 long: 1 -2.5,-1.27; 2 2.5,-1.27

### Placement (x,y rotation side)
C1  306.07,20.32 180 top
C2  308.61,53.34 180 top
C3  308.61,104.14 180 top
C4  294.64,53.34 180 top
C5  294.64,104.14 180 top
C6  279.4,53.34 180 top
C7  279.4,78.74 180 top
C8  279.4,104.14 180 top
C9  226.06,66.04 180 top
C10  226.06,99.06 180 top
C11  167.64,66.04 180 top
C12  167.64,99.06 180 top
C13  109.22,83.82 180 top
C14  96.52,83.82 180 top
C15  53.34,35.56 180 top
C16  22.86,40.64 270 top
D1  303.53,22.86 0 top
E1  307.34,40.64 270 top
E2  307.34,64.77 270 top
E3  307.34,80.01 270 top
E4  307.34,95.25 270 top
E5  293.37,40.64 270 top
E6  293.37,64.77 270 top
E7  293.37,80.01 270 top
E8  293.37,95.25 270 top
E9  278.13,40.64 270 top
E10  278.13,66.04 270 top
E11  278.13,91.44 270 top
E12  224.79,49.53 270 top
E13  224.79,82.55 270 top
E14  166.37,49.53 270 top
E15  166.37,82.55 270 top
E16  111.76,62.23 270 top
E17  91.44,62.23 270 top
E18  54.61,48.26 270 top
E19  29.21,46.99 270 top
FIELDS  41.91,46.99 270 top
H01  62.23,0 90 top
H02  125.73,0 90 top
H03  189.23,0 90 top
H04  252.73,0 90 top
H05  316.23,0 90 top
R1  285.75,20.32 0 top
R2  264.16,20.32 0 top
R3  303.53,25.4 180 top
R5  303.53,27.94 180 top
RESET  311.15,25.4 270 top
SV1  10.16,68.58 90 top
SV2  73.66,68.58 90 top
SV3  137.16,68.58 90 top
SV4  200.66,68.58 90 top
SV5  264.16,68.58 90 top
U$2  [STAND-OFF]  55.88,111.76 0 top
U$3  [STAND-OFF]  119.38,111.76 0 top
U$4  [STAND-OFF]  182.88,111.76 0 top
U$5  [STAND-OFF]  246.38,111.76 0 top
U$6  0,0 0 top
U$7  [STAND-OFF]  309.88,111.76 0 top
U$8  [STAND-OFF]  261.62,111.76 0 top
U$9  [STAND-OFF]  198.12,111.76 0 top
U$10  [STAND-OFF]  134.62,111.76 0 top
U$11  [STAND-OFF]  71.12,111.76 0 top
U$12  [STAND-OFF]  7.62,111.76 0 top
U$16  [STAND-OFF]  261.62,27.94 0 top
U$17  [STAND-OFF]  198.12,27.94 0 top
U$18  [STAND-OFF]  134.62,27.94 0 top
U$19  [STAND-OFF]  7.62,27.94 0 top
U$20  [STAND-OFF]  71.12,27.94 0 top
X1  17.78,110.49 0 top

### Tracks (layer width: path | path; a pad name or v marks a point on that pad's centre or on a via)
BMA00(1)  (via drill 0.81)  (1 unrouted)
  Top 0.406: SV1.24 10.16,67.31 13.97,67.31 17.78,63.5 17.78,34.29 v33.02,19.05
  Bottom 0.406: H01.K2 32.7,8.57 33.02,8.89 v33.02,19.05 | E16.23 118.11,67.31 101.6,67.31 100.33,66.04 E17.23 86.36,66.04 85.09,67.31 73.66,67.31 SV2.24
BMA01(1)  (via drill 0.81)  (1 unrouted)
  Top 0.406: SV1.20 10.16,62.23 13.97,62.23 16.51,59.69 16.51,29.21 v26.67,19.05
  Bottom 0.406: H01.M2 26.35,8.57 26.67,8.89 v26.67,19.05 | E16.21 118.11,62.23 101.6,62.23 100.33,60.96 E17.21 86.36,60.96 85.09,62.23 73.66,62.23 SV2.20
BMA02(1)  (1 unrouted)
  Bottom 0.406: H01.P2 20,8.57 20.32,8.89 20.32,13.97 13.97,20.32 10.16,20.32 3.81,26.67 3.81,63.5 SV1.26 | E16.24 118.11,69.85 101.6,69.85 100.33,68.58 E17.24 86.36,68.58 85.09,69.85 73.66,69.85 SV2.26
BMA03(1)  (via drill 0.81)  (1 unrouted)
  Top 0.406: SV1.28 7.62,71.12 3.81,67.31 3.81,25.4 10.16,19.05 v12.7,19.05
  Bottom 0.406: H01.S2 13.65,8.57 13.97,8.89 13.97,13.97 12.7,15.24 v12.7,19.05 | E16.25 118.11,72.39 101.6,72.39 100.33,71.12 E17.25 86.36,71.12 85.09,72.39 73.66,72.39 SV2.28
BMA04(1)  (1 unrouted)
  Bottom 0.406: H01.T2 10.48,8.57 10.16,8.89 10.16,19.05 2.54,26.67 2.54,68.58 6.35,72.39 10.16,72.39 SV1.29 | E16.3 101.6,73.66 100.33,72.39 86.36,72.39 85.09,73.66 E17.3 SV2.29
BMA05(1)  (via drill 0.81)  (1 unrouted)
  Top 0.406: SV1.27 10.16,72.39 6.35,72.39 3.81,69.85 2.54,68.58 2.54,20.32 v3.81,19.05
  Bottom 0.406: H01.V2 4.13,8.57 3.81,8.89 v3.81,19.05 | E16.4 101.6,71.12 100.33,69.85 86.36,69.85 85.09,71.12 E17.4 SV2.27
BMA06(1)  (via drill 0.81)
  Top 0.406: SV2.25 82.55,60.96 82.55,36.83 93.98,25.4 105.41,25.4 v111.76,19.05
  Bottom 0.406: H02.D2 112.08,8.57 111.76,8.89 v111.76,19.05 | E16.5 101.6,68.58 100.33,67.31 86.36,67.31 85.09,68.58 E17.5 SV2.25
BMA07(1)  (via drill 0.81)
  Top 0.406: SV2.23 81.28,59.69 81.28,36.83 93.98,24.13 104.14,24.13 v109.22,19.05
  Bottom 0.406: H02.E2 108.9,8.57 109.22,8.89 v109.22,19.05 | E16.6 101.6,66.04 100.33,64.77 86.36,64.77 85.09,66.04 E17.6 SV2.23
BMA08(1)  (via drill 0.81)
  Top 0.406: SV2.21 80.01,58.42 80.01,36.83 93.98,22.86 99.06,22.86 v102.87,19.05
  Bottom 0.406: H02.H2 102.55,8.57 102.87,8.89 v102.87,19.05 | E16.7 101.6,63.5 100.33,62.23 86.36,62.23 85.09,63.5 E17.7 SV2.21
BMA09(1)  (via drill 0.81)
  Top 0.406: SV2.19 78.74,57.15 78.74,36.83 v96.52,19.05
  Bottom 0.406: H02.K2 96.2,8.57 96.52,8.89 v96.52,19.05 | E16.8 101.6,60.96 100.33,59.69 86.36,59.69 85.09,60.96 E17.8 SV2.19
BMA10(1)  (via drill 0.81)
  Top 0.406: SV2.17 77.47,55.88 77.47,31.75 v90.17,19.05
  Bottom 0.406: H02.M2 89.85,8.57 90.17,8.89 v90.17,19.05 | E16.9 101.6,58.42 100.33,57.15 86.36,57.15 85.09,58.42 E17.9 SV2.17
BMA11(1)  (via drill 0.81)
  Top 0.406: SV2.15 76.2,54.61 76.2,26.67 v83.82,19.05
  Bottom 0.406: H02.P2 83.82,7.62 v83.82,19.05 | E16.10 101.6,55.88 100.33,54.61 86.36,54.61 85.09,55.88 E17.10 SV2.15
BTP2(0)  (via drill 0.81)
  Top 0.406: v287.02,50.8 287.02,96.52 E8.1
  Bottom 0.406: v287.02,50.8 297.18,50.8 302.26,45.72 302.26,44.45 E1.3
BTP2(1)
  Bottom 0.406: H05.V2 258.13,8.57 257.81,8.89 257.81,19.05 R2.1 267.97,29.21 280.67,29.21 284.48,33.02 284.48,50.8 288.29,54.61 298.45,54.61 303.53,49.53 E1.1
CS(0)  (via drill 0.81)  (1 unrouted)
  Top 0.406: SV5.18 264.16,59.69 266.7,59.69 267.97,60.96 v267.97,80.01
  Bottom 0.406: E16.20 118.11,59.69 101.6,59.69 100.33,58.42 E17.20 86.36,58.42 85.09,59.69 73.66,59.69 SV2.18 | E11.8 278.13,83.82 274.32,80.01 v267.97,80.01
D0  (2 unrouted)
  Bottom 0.406: E17.11 SV2.13 | SV3.13 140.97,53.34 142.24,54.61 168.91,54.61 E14.18 | E12.2 207.01,58.42 SV4.13
D1  (2 unrouted)
  Bottom 0.406: SV2.11 E17.12 | SV3.11 148.59,50.8 149.86,49.53 168.91,49.53 E14.16 | E12.4 204.47,53.34 SV4.11
D2  (2 unrouted)
  Bottom 0.406: SV2.9 E17.13 | SV3.9 139.7,48.26 143.51,44.45 168.91,44.45 E14.14 | E12.6 SV4.9
D3  (2 unrouted)
  Bottom 0.406: E17.15 86.36,45.72 85.09,46.99 73.66,46.99 SV2.8 | E14.12 168.91,39.37 144.78,39.37 139.7,44.45 137.16,44.45 SV3.8 | E12.8 204.47,43.18 203.2,44.45 200.66,44.45 SV4.8
D4  (via drill 0.81)  (2 unrouted)
  Top 0.406: SV4.10 196.85,45.72 v196.85,36.83
  Bottom 0.406: E17.16 86.36,48.26 85.09,49.53 73.66,49.53 SV2.10 | E14.9 146.05,40.64 139.7,46.99 137.16,46.99 SV3.10 | E12.11 227.33,36.83 v196.85,36.83
D5  (via drill 0.81)  (2 unrouted)
  Top 0.406: SV4.12 195.58,46.99 v195.58,41.91
  Bottom 0.406: E17.17 86.36,50.8 85.09,52.07 73.66,52.07 SV2.12 | SV3.12 137.16,49.53 139.7,49.53 143.51,45.72 E14.7 | E12.13 227.33,41.91 v195.58,41.91
D6  (via drill 0.81)  (2 unrouted)
  Top 0.406: SV4.14 194.31,48.26 v194.31,46.99
  Bottom 0.406: E17.18 86.36,53.34 85.09,54.61 73.66,54.61 SV2.14 | SV3.14 137.16,52.07 148.59,52.07 149.86,50.8 E14.5 | E12.15 227.33,46.99 v194.31,46.99
D7  (via drill 0.81)  (2 unrouted)
  Top 0.406: SV4.16 v193.04,49.53
  Bottom 0.406: E17.19 86.36,55.88 85.09,57.15 73.66,57.15 SV2.16 | SV3.16 137.16,57.15 161.29,57.15 E14.3 | E12.17 227.33,52.07 205.74,52.07 203.2,49.53 v193.04,49.53
D8  (via drill 0.81)  (2 unrouted)
  Top 0.406: SV3.6 132.08,43.18 130.81,44.45 v130.81,90.17 | SV4.6 200.66,44.45 203.2,44.45 204.47,45.72 204.47,74.93 E13.2
  Bottom 0.406: E16.11 107.95,49.53 107.95,43.18 106.68,41.91 73.66,41.91 SV2.6 | E15.18 168.91,90.17 v130.81,90.17
D9  (via drill 0.81)  (2 unrouted)
  Top 0.406: SV3.5 137.16,44.45 133.35,44.45 132.08,45.72 v132.08,85.09 | SV4.5 203.2,43.18 205.74,45.72 205.74,71.12 E13.4
  Bottom 0.406: E16.12 106.68,48.26 106.68,44.45 105.41,43.18 SV2.5 | E15.16 168.91,85.09 v132.08,85.09
D10  (via drill 0.81)  (2 unrouted)
  Top 0.406: SV3.7 137.16,46.99 134.62,46.99 133.35,48.26 v133.35,80.01 | SV4.7 203.2,46.99 203.2,76.2 v208.28,81.28
  Bottom 0.406: E16.13 105.41,46.99 105.41,44.45 76.2,44.45 SV2.7 | E15.14 168.91,80.01 v133.35,80.01 | v208.28,81.28 E13.6
D11  (via drill 0.81)  (2 unrouted)
  Top 0.406: SV3.4 130.81,40.64 128.27,43.18 v128.27,74.93 | SV4.4 200.66,41.91 203.2,41.91 207.01,45.72 207.01,62.23 E13.8
  Bottom 0.406: E16.15 113.03,39.37 73.66,39.37 SV2.4 | E15.12 168.91,74.93 v128.27,74.93
EA0(1)  (via drill 0.81)  (2 unrouted)
  Top 0.406: E19.3 27.94,53.34 27.94,63.5 12.7,78.74 SV1.33 | v156.21,78.74 156.21,38.1 v175.26,19.05
  Bottom 0.406: E16.1 101.6,78.74 100.33,77.47 86.36,77.47 85.09,78.74 E17.1 SV2.33 | H03.D2 175.58,8.57 175.26,8.89 v175.26,19.05 | SV3.33 v156.21,78.74
EA1(1)  (via drill 0.81)  (2 unrouted)
  Top 0.406: E19.2 26.67,54.61 26.67,63.5 12.7,77.47 10.16,77.47 10.16,74.93 SV1.30 | v154.94,72.39 154.94,36.83 v172.72,19.05
  Bottom 0.406: E16.26 118.11,74.93 101.6,74.93 100.33,73.66 E17.26 86.36,73.66 85.09,74.93 73.66,74.93 SV2.30 | H03.E2 172.4,8.57 172.72,8.89 v172.72,19.05 | v154.94,72.39 137.16,72.39 SV3.30
EA2(1)  (via drill 0.81)  (2 unrouted)
  Top 0.406: E19.1 25.4,63.5 12.7,76.2 SV1.31 | v153.67,77.47 153.67,31.75 v166.37,19.05
  Bottom 0.406: E16.2 101.6,76.2 100.33,74.93 86.36,74.93 85.09,76.2 E17.2 SV2.31 | H03.H2 166.05,8.57 166.37,8.89 v166.37,19.05 | SV3.31 139.7,77.47 v153.67,77.47
FS(1)  (via drill 0.81)  (1 unrouted)
  Top 0.406: SV1.34 7.62,80.01 7.62,100.33 19.05,100.33 59.69,59.69 59.69,41.91 E18.8 | SV5.34 260.35,81.28 v260.35,92.71 | v288.29,52.07 288.29,95.25 290.83,95.25 290.83,100.33 288.29,100.33 E11.12
  Bottom 0.406: v260.35,92.71 280.67,92.71 E11.12 | E1.4 304.8,41.91 304.8,44.45 E1.2 297.18,52.07 v288.29,52.07
GND  (via drill 0.81)  (4 unrouted)
  Top 0.711: C13.2 106.68,45.72 | 106.68,45.72 v106.68,38.1 106.68,27.94 v115.57,19.05 | v83.82,38.1 E17.14 93.98,55.88 C14.2 | E2.4 304.8,60.96 | 304.8,60.96 304.8,54.61 C2.2 306.07,35.56 E1.7 | E6.4 292.1,60.96 | 292.1,60.96 C4.2 292.1,35.56 E5.7 | 292.1,91.44 292.1,76.2 | 292.1,76.2 292.1,60.96 | E7.4 292.1,76.2 | E3.4 304.8,76.2 | 304.8,76.2 304.8,60.96 | E4.4 304.8,91.44 | 304.8,91.44 304.8,76.2 | E9.7 276.86,35.56 276.86,45.72 | 276.86,45.72 C6.2 275.59,54.61 275.59,58.42 | E9.2 276.86,45.72 | E10.7 275.59,58.42 | 275.59,83.82 275.59,95.25 E11.2 276.86,99.06 C8.2 | 275.59,83.82 275.59,78.74 | C7.2 275.59,78.74 | 275.59,78.74 275.59,71.12 | 275.59,71.12 275.59,58.42 | E11.7 275.59,83.82 | E10.2 275.59,71.12 | E16.14 106.68,45.72 | E15.10 165.1,71.12 | 165.1,71.12 C11.2 v165.1,38.1 E14.10 | C12.2 165.1,71.12 | 223.52,38.1 E12.10 | 223.52,38.1 C9.2 223.52,71.12 | E13.10 223.52,71.12 | C10.2 223.52,71.12 | v242.57,19.05 223.52,38.1 | E8.4 292.1,91.44 | 292.1,91.44 C5.2 | 304.8,91.44 304.8,102.87 C3.2 | R2.2 265.43,24.13 SV5.1
  Top 0.813: C15.2 E18.7
  Bottom 0.711: H02.C2 115.25,8.57 115.57,8.89 v115.57,19.05 | SV2.2 SV2.1 v83.82,38.1 v106.68,38.1 | H03.C2 178.75,8.57 179.07,8.89 179.07,13.97 177.8,15.24 v177.8,19.05 177.8,25.4 v165.1,38.1 | H04.C2 242.25,8.57 242.57,8.89 v242.57,19.05 | H05.C2 305.75,8.57 306.07,8.89 306.07,20.32 | SV3.2 SV3.1 E14.10 | SV5.2 SV5.1 270.51,33.02 E9.7 | E10.12 284.48,68.58 289.56,73.66 E7.4 | SV4.2 SV4.1 E12.10 | 306.07,20.32 306.07,30.48 E1.7 | 20.32,90.17 20.28,90.21 X1.2 | R1.2 298.45,20.32 C1.2 306.07,20.32 | C8.2 278.13,105.41 292.1,105.41 | 292.1,105.41 304.8,105.41 C3.2 | C5.2 292.1,105.41
  Bottom 0.813: H01.C2 51.75,8.57 52.07,8.89 52.07,13.97 50.8,15.24 50.8,33.02 | SV1.2 SV1.1 20.32,38.1 | 20.32,38.1 C16.2 E19.8 30.48,33.02 50.8,33.02 | 20.32,38.1 20.32,43.18 22.86,45.72 E19.5 E19.4 20.32,53.34 20.32,90.17 | 50.8,33.02 C15.2
  pour Bottom (isolate 0.711): 0,15.24 316.23,15.24 316.23,116.84 0,116.84
  pour Top (isolate 0.711): 0,15.24 316.23,15.24 316.23,116.84 0,116.84
MBODD_P  (via drill 0.81)  (1 unrouted)
  Top 0.406: v256.54,83.82 256.54,26.67 v264.16,19.05 | E15.11 171.45,72.39 171.45,76.2 | 171.45,76.2 171.45,81.28 | 171.45,81.28 171.45,85.09 E15.17 | E15.15 171.45,81.28 | E15.13 171.45,76.2
  Bottom 0.406: H05.T2 264.48,8.57 264.16,8.89 v264.16,19.05 | SV5.42 261.62,88.9 v256.54,83.82 | SV3.42 137.16,87.63 168.91,87.63 E15.17
MCBMB00(0)  (via drill 0.81)  (1 unrouted)
  Top 0.406: SV2.38 67.31,78.74 67.31,25.4 73.66,19.05 v77.47,19.05 | SV3.38 137.16,82.55 139.7,82.55 144.78,77.47 v144.78,58.42
  Bottom 0.406: H02.S2 77.47,7.62 v77.47,19.05 | v144.78,58.42 E14.2
MCBMB01(0)  (via drill 0.81)  (1 unrouted)
  Top 0.406: SV3.35 139.7,81.28 143.51,77.47 v143.51,53.34
  Bottom 0.406: H02.T2 73.98,8.57 73.66,8.89 73.66,19.05 67.31,25.4 67.31,76.2 71.12,80.01 73.66,80.01 SV2.35 | v143.51,53.34 E14.4
MCBMB02(0)  (via drill 0.81)  (1 unrouted)
  Top 0.406: SV3.36 137.16,80.01 139.7,80.01 142.24,77.47 v142.24,49.53
  Bottom 0.406: H02.V2 67.63,8.57 67.31,8.89 67.31,19.05 66.04,20.32 66.04,76.2 71.12,81.28 SV2.36 | E14.6 143.51,48.26 v142.24,49.53
MCBMB03(0)  (via drill 0.81)  (1 unrouted)
  Top 0.406: E14.8 161.29,44.45 161.29,90.17 156.21,95.25 137.16,95.25 SV3.46 | v48.26,19.05 48.26,66.04 19.05,95.25 10.16,95.25 SV1.46
  Bottom 0.406: H01.D2 48.58,8.57 48.26,8.89 v48.26,19.05
MCBMB04(0)  (via drill 0.81)  (1 unrouted)
  Top 0.406: v168.91,36.83 161.29,36.83 160.02,38.1 160.02,90.17 156.21,93.98 148.59,93.98 147.32,92.71 137.16,92.71 SV3.44 | v45.72,19.05 46.99,20.32 46.99,63.5 17.78,92.71 10.16,92.71 SV1.44
  Bottom 0.406: H01.E2 45.72,7.62 v45.72,19.05 | E14.11 v168.91,36.83
MCBMB05(0)  (via drill 0.81)  (1 unrouted)
  Top 0.406: v158.75,41.91 158.75,90.17 156.21,92.71 148.59,92.71 147.32,91.44 SV3.43 | SV1.43 16.51,91.44 45.72,62.23 45.72,25.4 v39.37,19.05
  Bottom 0.406: E14.13 168.91,41.91 v158.75,41.91 | H01.H2 39.37,8.26 v39.37,19.05
MCBMB06(0)  (via drill 0.81)
  Top 0.406: v152.4,46.99 152.4,26.67 v160.02,19.05
  Bottom 0.406: H03.K2 159.7,8.57 160.02,8.89 v160.02,19.05 | v152.4,46.99 168.91,46.99 E14.15
MCBMB07(0)  (via drill 0.81)
  Top 0.406: v151.13,52.07 151.13,21.59 v153.67,19.05
  Bottom 0.406: H03.M2 153.35,8.57 153.67,8.89 v153.67,19.05 | v151.13,52.07 168.91,52.07 E14.17
MCBMB08(0)  (via drill 0.81)
  Top 0.406: v149.86,91.44 149.86,21.59 v147.32,19.05
  Bottom 0.406: H03.P2 147,8.57 147.32,8.89 v147.32,19.05 | v149.86,91.44 E15.2
MCBMB09(0)  (via drill 0.81)
  Top 0.406: v148.59,86.36 148.59,26.67 v140.97,19.05
  Bottom 0.406: H03.S2 140.65,8.57 140.97,8.89 v140.97,19.05 | v148.59,86.36 E15.4
MCBMB10(0)  (via drill 0.81)
  Top 0.406: v147.32,81.28 147.32,29.21 v137.16,19.05
  Bottom 0.406: v147.32,81.28 E15.6 | H03.T2 137.16,8.26 v137.16,19.05
MCBMB11(0)  (via drill 0.81)
  Top 0.406: v146.05,76.2 146.05,34.29 v130.81,19.05
  Bottom 0.406: H03.V2 131.13,8.57 130.81,8.89 v130.81,19.05 | v146.05,76.2 E15.8
MEM00  (via drill 0.81)
  Top 0.406: v218.44,54.61 218.44,36.83 v236.22,19.05
  Bottom 0.406: H04.E2 236.22,7.62 v236.22,19.05 | v218.44,54.61 227.33,54.61 E12.18
MEM01  (via drill 0.81)
  Top 0.406: v217.17,49.53 217.17,31.75 v229.87,19.05
  Bottom 0.406: H04.H2 229.87,7.62 v229.87,19.05 | v217.17,49.53 227.33,49.53 E12.16
MEM02  (via drill 0.81)
  Top 0.406: v215.9,44.45 215.9,26.67 v223.52,19.05
  Bottom 0.406: H04.K2 223.2,8.57 223.52,8.89 v223.52,19.05 | v215.9,44.45 227.33,44.45 E12.14
MEM03  (via drill 0.81)
  Top 0.406: v214.63,39.37 214.63,21.59 v217.17,19.05
  Bottom 0.406: H04.M2 216.85,8.57 217.17,8.89 v217.17,19.05 | v214.63,39.37 227.33,39.37 E12.12
MEM04  (via drill 0.81)
  Top 0.406: v213.36,40.64 213.36,21.59 v210.82,19.05
  Bottom 0.406: H04.P2 210.5,8.57 210.82,8.89 v210.82,19.05 | v213.36,40.64 E12.9
MEM05  (via drill 0.81)
  Top 0.406: v212.09,45.72 212.09,26.67 v204.47,19.05
  Bottom 0.406: H04.S2 204.15,8.57 204.47,8.89 v204.47,19.05 | v212.09,45.72 E12.7
MEM06  (via drill 0.81)
  Top 0.406: v210.82,50.8 210.82,29.21 v200.66,19.05
  Bottom 0.406: H04.T2 200.98,8.57 200.66,8.89 v200.66,19.05 | v210.82,50.8 E12.5
MEM07  (via drill 0.81)
  Top 0.406: v209.55,55.88 209.55,34.29 v194.31,19.05
  Bottom 0.406: v209.55,55.88 E12.3 | H04.V2 194.31,8.26 v194.31,19.05
MEM08  (via drill 0.81)  (1 unrouted)
  Top 0.406: v273.05,85.09 273.05,30.48 274.32,29.21 289.56,29.21 v302.26,16.51
  Bottom 0.406: H05.D2 302.58,8.57 302.26,8.89 v302.26,16.51 | E13.18 227.33,87.63 203.2,87.63 SV4.41 | v273.05,85.09 269.24,88.9 SV5.41
MEM09  (via drill 0.81)  (1 unrouted)
  Top 0.406: v271.78,83.82 271.78,30.48 274.32,27.94 288.29,27.94 v299.72,16.51
  Bottom 0.406: H05.E2 299.4,8.57 299.72,8.89 v299.72,16.51 | v271.78,83.82 269.24,86.36 SV5.39 | E13.16 227.33,82.55 207.01,82.55 203.2,86.36 SV4.39
MEM10  (via drill 0.81)  (1 unrouted)
  Top 0.406: v270.51,82.55 270.51,30.48 274.32,26.67 287.02,26.67 293.37,20.32 v293.37,19.05
  Bottom 0.406: H05.H2 293.05,8.57 293.37,8.89 v293.37,19.05 | v270.51,82.55 267.97,85.09 264.16,85.09 SV5.40 | E13.14 227.33,77.47 209.55,77.47 204.47,82.55 204.47,83.82 203.2,85.09 200.66,85.09 SV4.40
MEM11  (via drill 0.81)  (1 unrouted)
  Top 0.406: v269.24,81.28 269.24,30.48 274.32,25.4 280.67,25.4 v287.02,19.05
  Bottom 0.406: H05.K2 286.7,8.57 287.02,8.89 v287.02,19.05 | v269.24,81.28 266.7,83.82 SV5.37 | E13.12 227.33,74.93 210.82,74.93 SV4.37
MEM_P  (via drill 0.81)
  Top 0.406: E13.9 219.71,72.39 219.71,36.83 220.98,35.56 222.25,35.56 v238.76,19.05
  Bottom 0.406: H04.D2 239.08,9.84 238.76,10.16 v238.76,19.05
MEMDONE(0)
  Bottom 0.406: H05.S2 267.65,8.57 267.97,8.89 267.97,15.24 287.02,34.29 287.02,45.72 E5.1
MEMDONE(1)  (via drill 0.81)
  Top 0.406: v279.4,39.37 285.75,39.37 E5.3
  Bottom 0.406: E5.2 E5.3 | E9.5 278.13,38.1 v279.4,39.37
MEMSTART(0)
  Top 0.406: E1.6 302.26,36.83 302.26,97.79 E4.1
  Bottom 0.406: RESET.3 309.88,24.13 309.88,26.67 307.34,26.67 307.34,31.75 E1.6
MEMSTART(1)
  Bottom 0.406: E1.5 300.99,35.56 300.99,25.4 299.72,24.13 284.48,24.13 R1.1 280.67,8.89 280.35,8.57 H05.M2
MS100  (via drill 0.81)
  Top 0.406: E1.13 308.61,48.26 v308.61,96.52
  Bottom 0.406: E1.13 E1.12 | v308.61,96.52 E4.2
MS150
  Bottom 0.406: E11.4 278.13,87.63 290.83,87.63 295.91,92.71 309.88,92.71 E4.6
MS250
  Bottom 0.406: E3.1 E4.5
MS350
  Bottom 0.406: E3.2 300.99,81.28 299.72,82.55 294.64,82.55 292.1,80.01 288.29,80.01 287.02,78.74 287.02,76.2 283.21,72.39 280.67,72.39 E10.4
MS400
  Bottom 0.406: E3.6 307.34,82.55 300.99,82.55 298.45,85.09 294.64,85.09 292.1,82.55 278.13,82.55 274.32,78.74 E10.1
MS500
  Bottom 0.406: E2.1 E3.5
MS650
  Bottom 0.406: E2.6 312.42,64.77 312.42,100.33 311.15,101.6 281.94,101.6 279.4,99.06 E11.1
N$1
  Top 0.406: RESET.2 312.42,26.67 312.42,34.29 E1.9 E1.10
N$18
  Bottom 0.406: E19.15 35.56,55.88 FIELDS.1
N$19
  Bottom 0.406: E19.14 35.56,53.34 FIELDS.3
N$20
  Bottom 0.406: E19.13 35.56,50.8 FIELDS.5
N$21
  Bottom 0.406: E19.12 35.56,48.26 FIELDS.7
N$22
  Bottom 0.406: E19.11 35.56,45.72 FIELDS.9
N$23
  Bottom 0.406: E19.10 35.56,43.18 FIELDS.11
N$24
  Bottom 0.406: E19.9 35.56,40.64 FIELDS.13
N$25
  Bottom 0.406: FIELDS.15 35.56,38.1 33.02,35.56 27.94,40.64 E19.7
N$26
  Bottom 0.406: FIELDS.8 E18.4
N$27
  Bottom 0.406: FIELDS.6 E18.3
N$28
  Bottom 0.406: E18.2 FIELDS.4
N$29
  Bottom 0.406: FIELDS.2 E18.1
N$30
  Bottom 0.406: FIELDS.10 E18.5
N$31
  Bottom 0.406: FIELDS.12 E18.6
N$32
  Bottom 0.406: FIELDS.14 44.45,41.91 52.07,41.91 54.61,44.45 54.61,46.99 E18.12
N$33
  Bottom 0.406: E18.11 55.88,45.72 55.88,43.18 50.8,38.1 FIELDS.16
NS100  (via drill 0.81)
  Top 0.406: E1.11 307.34,44.45 v307.34,95.25
  Bottom 0.406: E11.11 284.48,91.44 288.29,95.25 v307.34,95.25
OE(0)  (2 unrouted)
  Top 0.406: SV5.22 264.16,64.77 266.7,64.77 266.7,83.82 269.24,86.36 E11.6
  Bottom 0.406: E16.22 118.11,64.77 101.6,64.77 100.33,63.5 E17.22 86.36,63.5 85.09,64.77 73.66,64.77 SV2.22 | E13.1 226.06,93.98 E13.19 229.87,90.17 229.87,59.69 E12.19 226.06,60.96 E12.1 219.71,62.23 200.66,62.23 SV4.22
PARITY  (via drill 0.81)  (2 unrouted)
  Top 0.406: SV3.3 137.16,41.91 130.81,41.91 129.54,43.18 v129.54,69.85 | SV4.3 203.2,40.64 208.28,45.72 208.28,60.96 v215.9,68.58 | E13.11 229.87,72.39 229.87,76.2 | 229.87,76.2 229.87,81.28 | 229.87,81.28 229.87,85.09 E13.17 | E13.15 229.87,81.28 | E13.13 229.87,76.2
  Bottom 0.406: E16.16 111.76,40.64 SV2.3 | E15.9 158.75,69.85 v129.54,69.85 | v215.9,68.58 226.06,68.58 E13.11
PWR_OK
  Top 0.406: R3.1 307.34,25.4 298.45,34.29 298.45,39.37 E5.11
  Bottom 0.406: E5.12 E5.11 | C1.1 D1.A R3.1
PWR_OK(0)
  Top 0.406: E5.13 299.72,43.18 299.72,34.29 306.07,27.94 R5.1
  Bottom 0.406: R5.1 RESET.1
RESET  (via drill 0.81)
  Top 0.406: v278.13,93.98 v278.13,72.39 v278.13,66.04 v278.13,57.15
  Bottom 0.406: v278.13,93.98 E11.3 | v278.13,66.04 E10.11 | E10.3 v278.13,72.39 | E9.3 273.05,44.45 273.05,52.07 v278.13,57.15 283.21,57.15 288.29,62.23 290.83,62.23 295.91,67.31 304.8,67.31 309.88,62.23 312.42,62.23 312.42,34.29 E1.8
STROBE(0)
  Bottom 0.406: H05.P2 274.32,8.26 274.32,19.05 288.29,33.02 288.29,39.37 E5.4
STROBE(1)  (via drill 0.81)
  Top 0.406: v276.86,60.96 276.86,55.88 278.13,54.61 278.13,38.1 279.4,36.83 288.29,36.83 E5.5
  Bottom 0.406: E5.5 E5.6 | E10.5 v276.86,60.96
TP150  (via drill 0.81)
  Top 0.406: v299.72,77.47 299.72,91.44 E8.6
  Bottom 0.406: E10.10 295.91,77.47 v299.72,77.47
TP250
  Bottom 0.406: E8.5 E7.1
TP300
  Bottom 0.406: E10.13 283.21,71.12 288.29,76.2 288.29,77.47 293.37,77.47 E7.7
TP500  (via drill 0.81)
  Top 0.406: v284.48,93.98 v284.48,63.5 v284.48,53.34
  Bottom 0.406: E7.5 E6.1 v284.48,63.5 | E9.4 275.59,41.91 275.59,44.45 v284.48,53.34 | E11.13 v284.48,93.98
TP550
  Bottom 0.406: E9.1 281.94,55.88 287.02,55.88 E6.7
VCC  (4 unrouted)
  Top 0.711: E9.14 C6.1 280.67,54.61 280.67,72.39 E10.14 C7.1 280.67,80.01 280.67,88.9 | E6.8 294.64,68.58 | 294.64,68.58 294.64,53.34 | 294.64,53.34 294.64,48.26 | 309.88,68.58 309.88,54.61 C2.1 E1.14 | 309.88,68.58 E2.8 | 294.64,83.82 294.64,96.52 E8.8 C5.1 297.18,105.41 | 294.64,83.82 294.64,68.58 | E7.8 294.64,83.82 | 309.88,83.82 309.88,97.79 E4.8 C3.1 309.88,105.41 297.18,105.41 | 309.88,83.82 309.88,68.58 | E3.8 309.88,83.82 | 280.67,88.9 280.67,97.79 E11.14 C8.1 283.21,105.41 297.18,105.41 | E11.10 280.67,88.9 | E14.20 C11.1 167.64,68.58 167.64,91.44 E15.20 C12.1 167.64,101.6 140.97,101.6 SV3.49 | E12.20 C9.1 226.06,68.58 226.06,91.44 E13.20 C10.1 226.06,101.6 204.47,101.6 SV4.49 | SV1.49 17.78,99.06 58.42,58.42 E18.14 | C14.1 83.82,99.06 SV2.49 | 294.64,48.26 294.64,38.1 E5.9 | E5.14 294.64,48.26 | C4.1 294.64,53.34 | D1.C R3.2
  Top 0.813: E18.14 55.88,53.34 C15.1
  Bottom 0.711: E17.28 99.06,81.28 | 99.06,81.28 111.76,81.28 | 111.76,81.28 116.84,81.28 E16.28 | E19.6 C16.1 | C13.1 111.76,81.28 | C14.1 99.06,81.28 | SV3.50 SV3.49 | SV2.50 SV2.49 | SV4.50 SV4.49 | SV5.50 SV5.49 267.97,101.6 279.4,101.6 C8.1 | SV1.49 15.24,102.87 15.24,109.22 X1.1 | E5.9 E5.8 298.45,31.75 R5.2 R3.2 | E9.10 E9.11 E9.12 E9.13 E9.14
  Bottom 0.813: E19.6 29.21,46.99 29.21,52.07 E19.16 35.56,58.42 55.88,58.42 E18.14 | SV1.50 SV1.49
WE(0)  (via drill 0.81)  (2 unrouted)
  Top 0.406: SV3.32 137.16,74.93 139.7,74.93 140.97,73.66 v140.97,60.96
  Bottom 0.406: E16.27 118.11,77.47 101.6,77.47 100.33,76.2 E17.27 86.36,76.2 85.09,77.47 73.66,77.47 SV2.32 | E15.1 167.64,93.98 E15.19 171.45,90.17 171.45,59.69 E14.19 167.64,58.42 165.1,60.96 E14.1 v140.97,60.96 | E10.8 275.59,64.77 261.62,64.77 260.35,66.04 260.35,73.66 SV5.32

### Text on the board
Top: 8i H01 | 8i H02 | 8i H03 | 8i H04 | 8i H05 | 12 N20 | 12 N21 | 12 N22 | 12 N23 | 12 N24
Bottom: 8i H01 | 8i H02 | 8i H03 | 8i H04 | 8i H05 | 12 N20 | 12 N21 | 12 N22 | 12 N23 | 12 N24
tPlace: 7 6 5 4 3 2 1 0 | R1, R2 are needed if cabling was used.
tValues: 8i H01 | 8i H02 | 8i H03 | 8i H04 | 8i H05 | 12 N20 | 12 N21 | 12 N22 | 12 N23 | 12 N24 | VCC | GND